# EAGLE design oresat0-backplane (EAGLE 9.6.2)

## Sheet 1 of 9: Slot 1
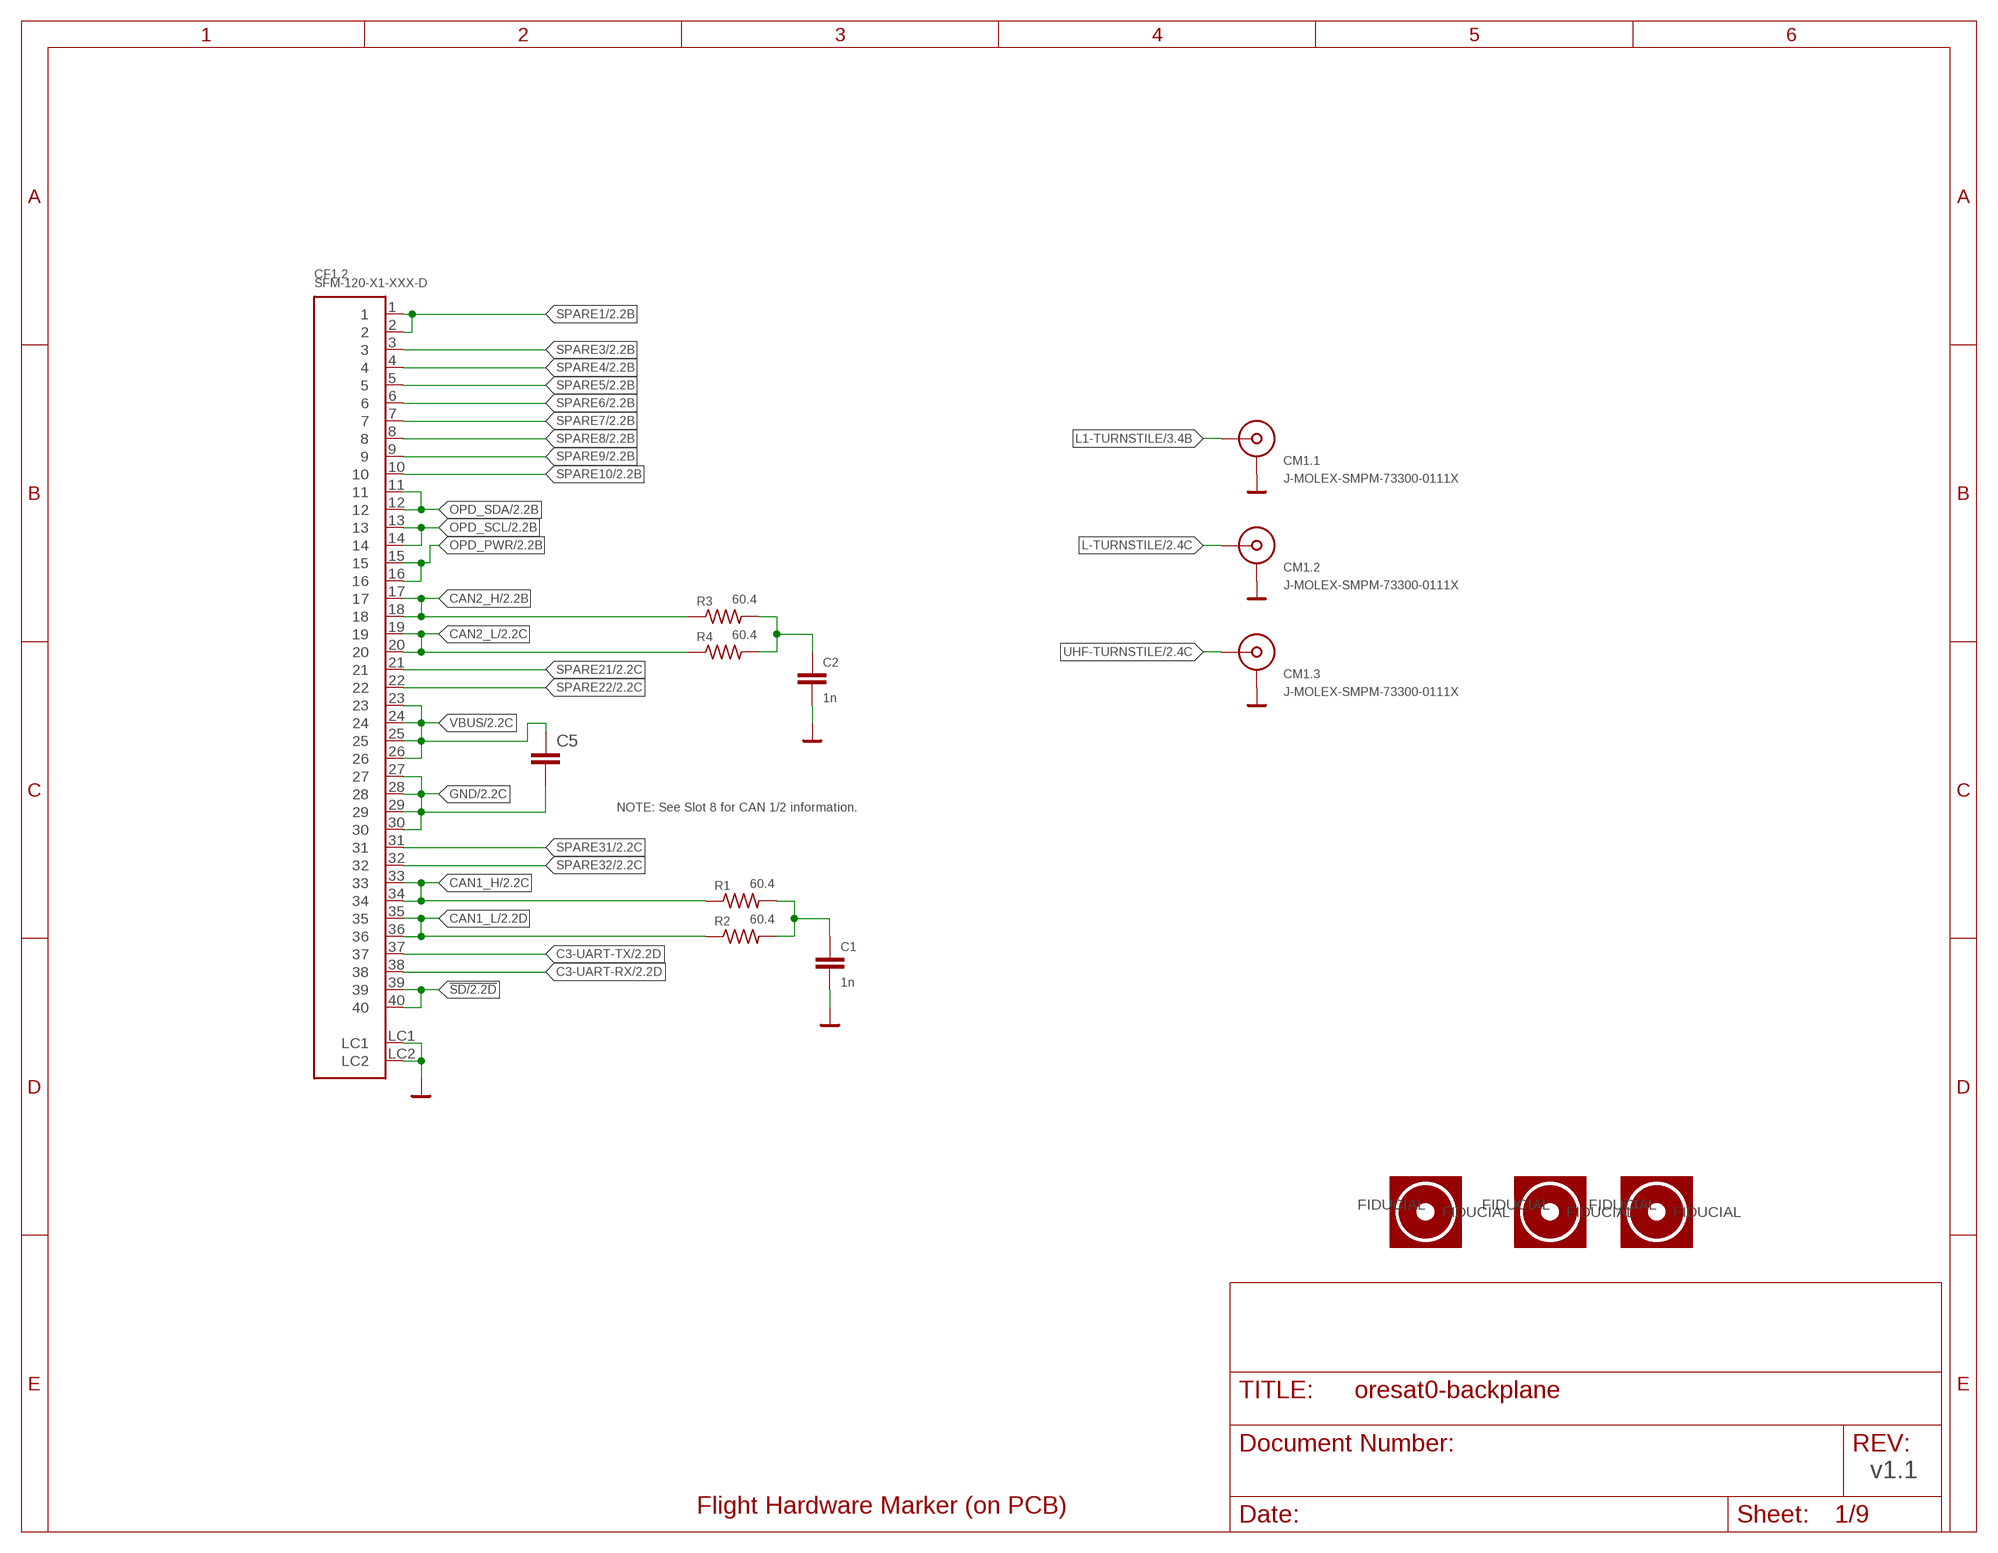
[diagram p0: schematic, sheet 1]

### Parts
C1  1n  C-EU0603-C-NOSILK  [.0603-C-NOSILK]
C2  1n  C-EU0603-C-NOSILK  [.0603-C-NOSILK]
C5  C-EU1206-B  [1206-B]
CF1.2  SFM-120-X1-XXX-D  [SFM-120-X1-XXX-D]
CM1.1  J-MOLEX-SMPM-73300-0111X  [J-MOLEX-SMPM-73300-0111X]
CM1.2  J-MOLEX-SMPM-73300-0111X  [J-MOLEX-SMPM-73300-0111X]
CM1.3  J-MOLEX-SMPM-73300-0111X  [J-MOLEX-SMPM-73300-0111X]
FIDUCIAL1  FIDUCIAL-1.0X2.0  [FIDUCIAL-1.0X2.0]
FIDUCIAL2  FIDUCIAL-1.0X2.0  [FIDUCIAL-1.0X2.0]
FIDUCIAL3  FIDUCIAL-1.0X2.0  [FIDUCIAL-1.0X2.0]
R1  60.4  R-US_1206-C  [1206-C]
R2  60.4  R-US_1206-C  [1206-C]
R3  60.4  R-US_1206-C  [1206-C]
R4  60.4  R-US_1206-C  [1206-C]
U$1  FLIGHMARKERNEW  [FLIGHTMARKER_NEW_BOARDS]

### Nets
!SD [SHUTDOWN]: CF1.2.39 CF1.2.40 ; also sheet 2,3,4,5,6,7
C3-UART-RX: CF1.2.38 ; also sheet 2,3,4,5,6,7
C3-UART-TX: CF1.2.37 ; also sheet 2,3,4,5,6,7
CAN1_H: CF1.2.33 CF1.2.34 R1.1 ; also sheet 2,3,4,5,6,7,8
CAN1_L: CF1.2.35 CF1.2.36 R2.1 ; also sheet 2,3,4,5,6,7,8
CAN2_H: CF1.2.17 CF1.2.18 R3.1 ; also sheet 2,3,4,5,6,7,8
CAN2_L: CF1.2.19 CF1.2.20 R4.1 ; also sheet 2,3,4,5,6,7,8
GND: C1.2 C2.2 C5.2 CF1.2.27 CF1.2.28 CF1.2.29 CF1.2.30 CF1.2.LC1 CF1.2.LC2 CM1.1.P$1(SHIELD1) CM1.1.P$2(SHIELD1) CM1.1.P$3(SHIELD1) CM1.1.P$4(SHIELD1) CM1.2.P$1(SHIELD1) CM1.2.P$2(SHIELD1) CM1.2.P$3(SHIELD1) CM1.2.P$4(SHIELD1) CM1.3.P$1(SHIELD1) CM1.3.P$2(SHIELD1) CM1.3.P$3(SHIELD1) CM1.3.P$4(SHIELD1) ; also sheet 2,3,4,5,6,7,8,9
L1-TURNSTILE [RF]: CM1.1.RF-DOWN(RF) ; also sheet 3
L-TURNSTILE [RF]: CM1.2.RF-DOWN(RF) ; also sheet 2
N$1: C2.1 R3.2 R4.2
N$2: C1.1 R1.2 R2.2
OPD_PWR: CF1.2.15 CF1.2.16 ; also sheet 2,3,4,5,6,7
OPD_SCL: CF1.2.13 CF1.2.14 ; also sheet 2,3,4,5,6,7
OPD_SDA: CF1.2.11 CF1.2.12 ; also sheet 2,3,4,5,6,7
SPARE1: CF1.2.1 CF1.2.2 ; also sheet 2,3,4,5,6,7,9
SPARE3: CF1.2.3 ; also sheet 2,3,4,5,6,7,9
SPARE4: CF1.2.4 ; also sheet 2,3,4,5,6,7,9
SPARE5: CF1.2.5 ; also sheet 2,3,4,5,6,7,9
SPARE6: CF1.2.6 ; also sheet 2,3,4,5,6,7,9
SPARE7: CF1.2.7 ; also sheet 2,3,4,5,6,7,9
SPARE8: CF1.2.8 ; also sheet 2,3,4,5,6,7,9
SPARE9: CF1.2.9 ; also sheet 2,3,4,5,6,7,9
SPARE10: CF1.2.10 ; also sheet 2,3,4,5,6,7,9
SPARE21: CF1.2.21 ; also sheet 2,3,4,5,6,7
SPARE22: CF1.2.22 ; also sheet 2,3,4,5,6,7
SPARE31: CF1.2.31 ; also sheet 2,3,4,5,6,7
SPARE32: CF1.2.32 ; also sheet 2,3,4,5,6,7
UHF-TURNSTILE [RF]: CM1.3.RF-DOWN(RF) ; also sheet 2
VBUS: C5.1 CF1.2.23 CF1.2.24 CF1.2.25 CF1.2.26 ; also sheet 2,3,4,5,6,7
Unconnected: FIDUCIAL1.FIDUCIAL FIDUCIAL2.FIDUCIAL FIDUCIAL3.FIDUCIAL

### Notes on the sheet
- NOTE: See Slot 8 for CAN 1/2 information.
- v1.1

## Sheet 2 of 9: Slot 2
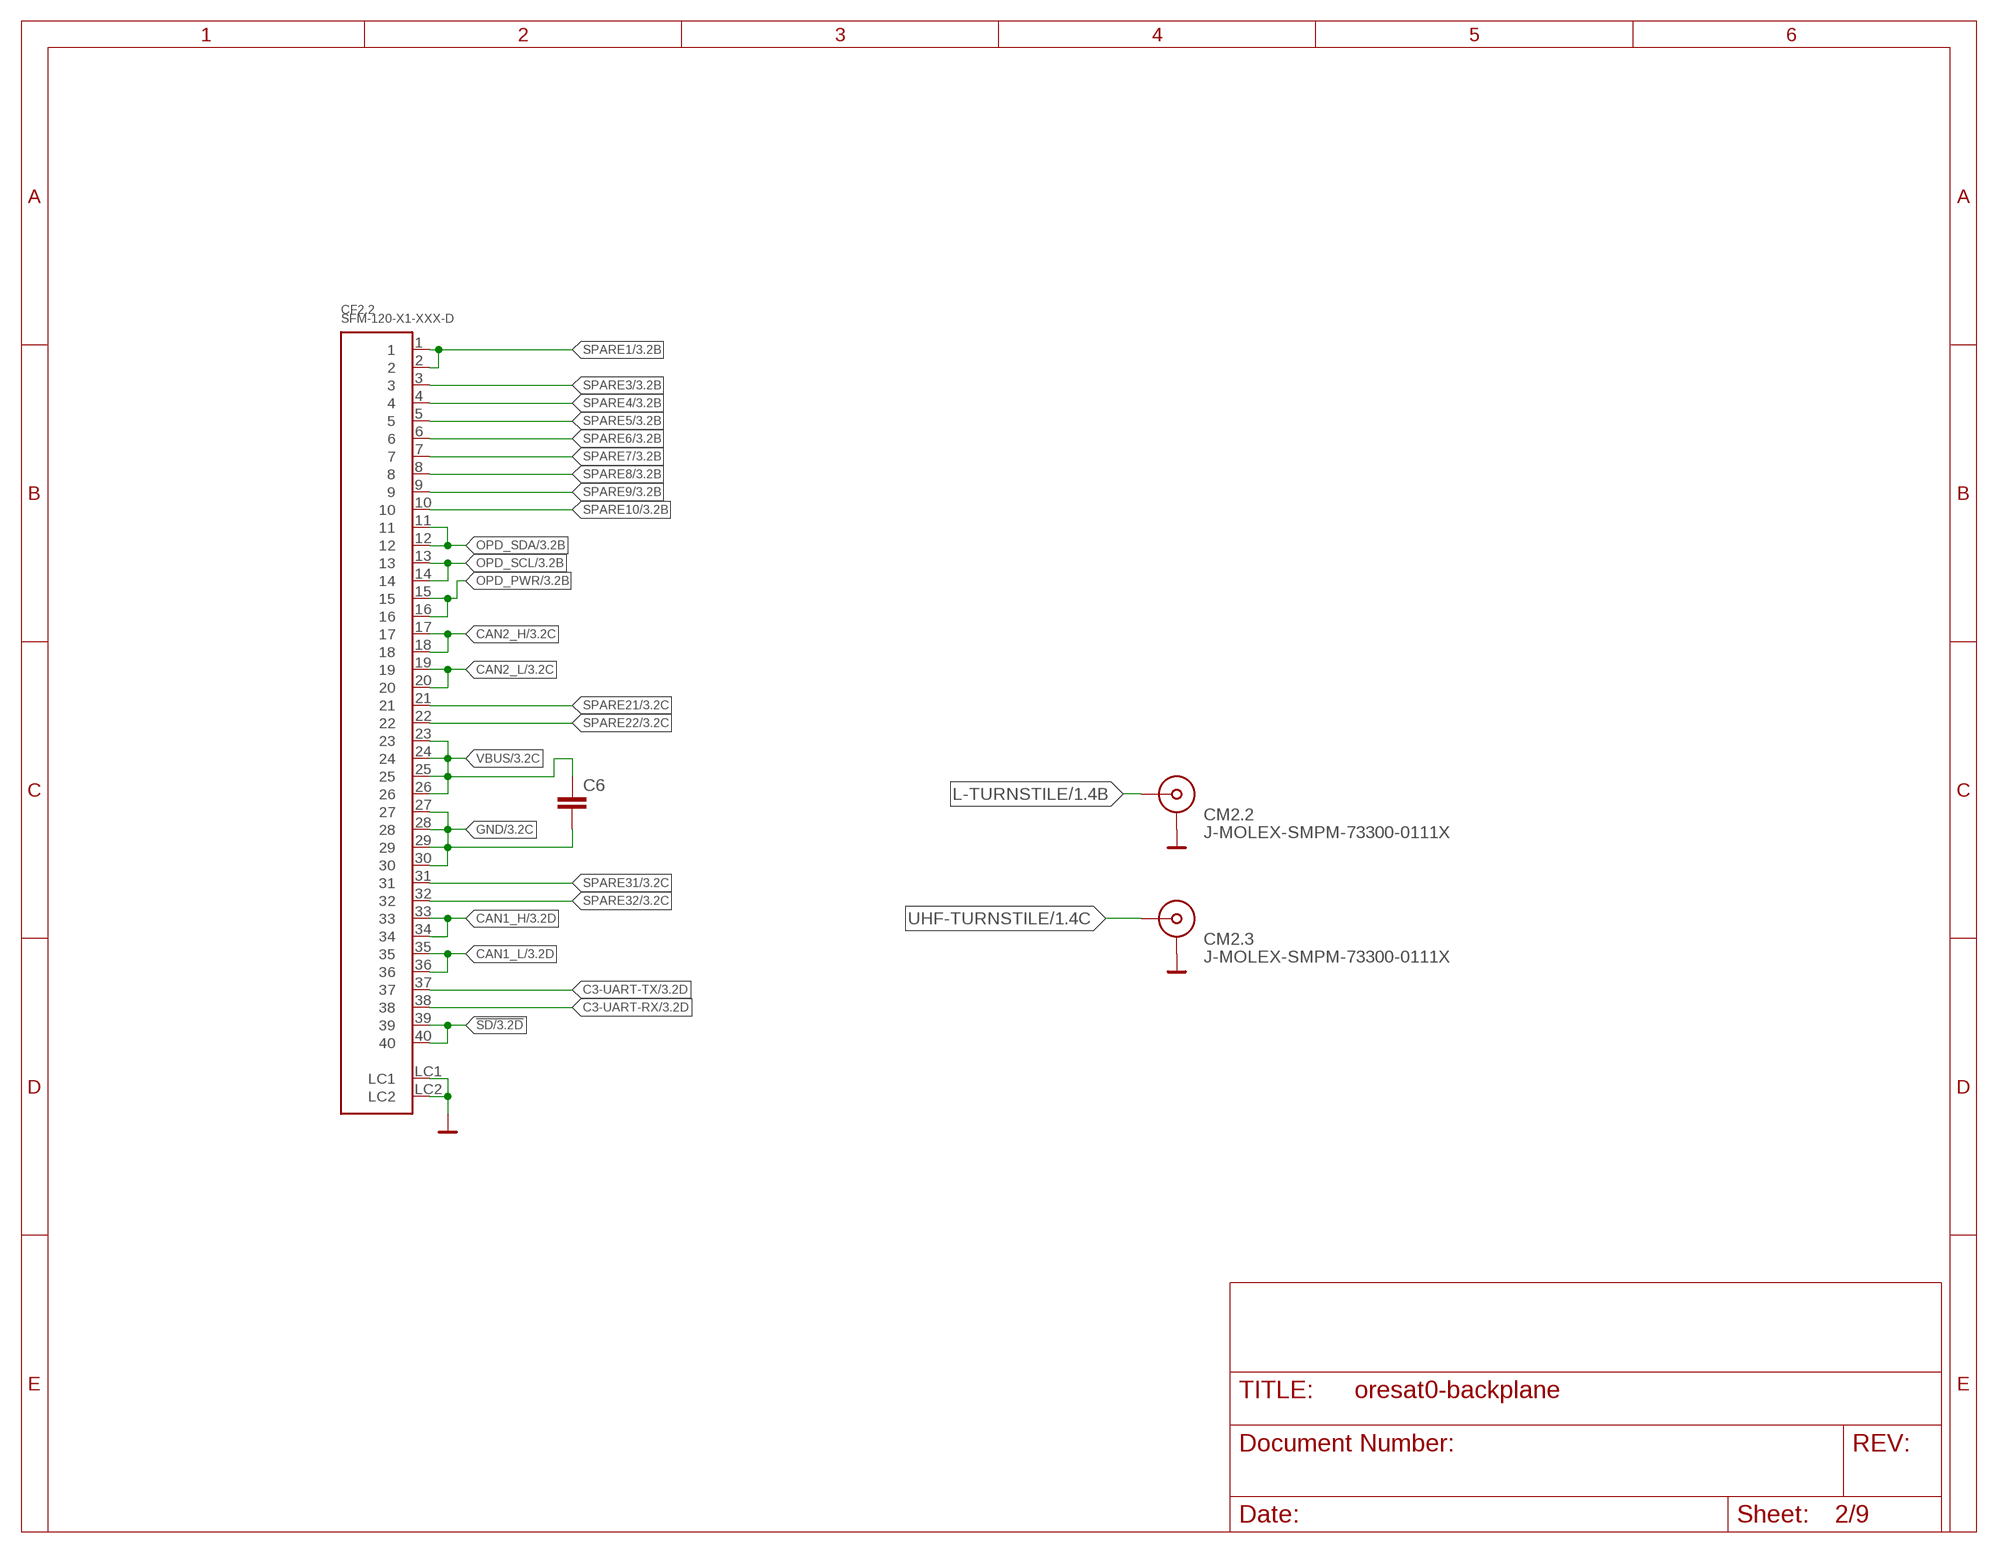
[diagram p1: schematic, sheet 2]

### Parts
C6  C-EU1206-B  [1206-B]
CF2.2  SFM-120-X1-XXX-D  [SFM-120-X1-XXX-D]
CM2.2  J-MOLEX-SMPM-73300-0111X  [J-MOLEX-SMPM-73300-0111X]
CM2.3  J-MOLEX-SMPM-73300-0111X  [J-MOLEX-SMPM-73300-0111X]

### Nets
!SD [SHUTDOWN]: CF2.2.39 CF2.2.40 ; also sheet 1,3,4,5,6,7
C3-UART-RX: CF2.2.38 ; also sheet 1,3,4,5,6,7
C3-UART-TX: CF2.2.37 ; also sheet 1,3,4,5,6,7
CAN1_H: CF2.2.33 CF2.2.34 ; also sheet 1,3,4,5,6,7,8
CAN1_L: CF2.2.35 CF2.2.36 ; also sheet 1,3,4,5,6,7,8
CAN2_H: CF2.2.17 CF2.2.18 ; also sheet 1,3,4,5,6,7,8
CAN2_L: CF2.2.19 CF2.2.20 ; also sheet 1,3,4,5,6,7,8
GND: C6.2 CF2.2.27 CF2.2.28 CF2.2.29 CF2.2.30 CF2.2.LC1 CF2.2.LC2 CM2.2.P$1(SHIELD1) CM2.2.P$2(SHIELD1) CM2.2.P$3(SHIELD1) CM2.2.P$4(SHIELD1) CM2.3.P$1(SHIELD1) CM2.3.P$2(SHIELD1) CM2.3.P$3(SHIELD1) CM2.3.P$4(SHIELD1) ; also sheet 1,3,4,5,6,7,8,9
L-TURNSTILE [RF]: CM2.2.RF-DOWN(RF) ; also sheet 1
OPD_PWR: CF2.2.15 CF2.2.16 ; also sheet 1,3,4,5,6,7
OPD_SCL: CF2.2.13 CF2.2.14 ; also sheet 1,3,4,5,6,7
OPD_SDA: CF2.2.11 CF2.2.12 ; also sheet 1,3,4,5,6,7
SPARE1: CF2.2.1 CF2.2.2 ; also sheet 1,3,4,5,6,7,9
SPARE3: CF2.2.3 ; also sheet 1,3,4,5,6,7,9
SPARE4: CF2.2.4 ; also sheet 1,3,4,5,6,7,9
SPARE5: CF2.2.5 ; also sheet 1,3,4,5,6,7,9
SPARE6: CF2.2.6 ; also sheet 1,3,4,5,6,7,9
SPARE7: CF2.2.7 ; also sheet 1,3,4,5,6,7,9
SPARE8: CF2.2.8 ; also sheet 1,3,4,5,6,7,9
SPARE9: CF2.2.9 ; also sheet 1,3,4,5,6,7,9
SPARE10: CF2.2.10 ; also sheet 1,3,4,5,6,7,9
SPARE21: CF2.2.21 ; also sheet 1,3,4,5,6,7
SPARE22: CF2.2.22 ; also sheet 1,3,4,5,6,7
SPARE31: CF2.2.31 ; also sheet 1,3,4,5,6,7
SPARE32: CF2.2.32 ; also sheet 1,3,4,5,6,7
UHF-TURNSTILE [RF]: CM2.3.RF-DOWN(RF) ; also sheet 1
VBUS: C6.1 CF2.2.23 CF2.2.24 CF2.2.25 CF2.2.26 ; also sheet 1,3,4,5,6,7

## Sheet 3 of 9: Slot 3
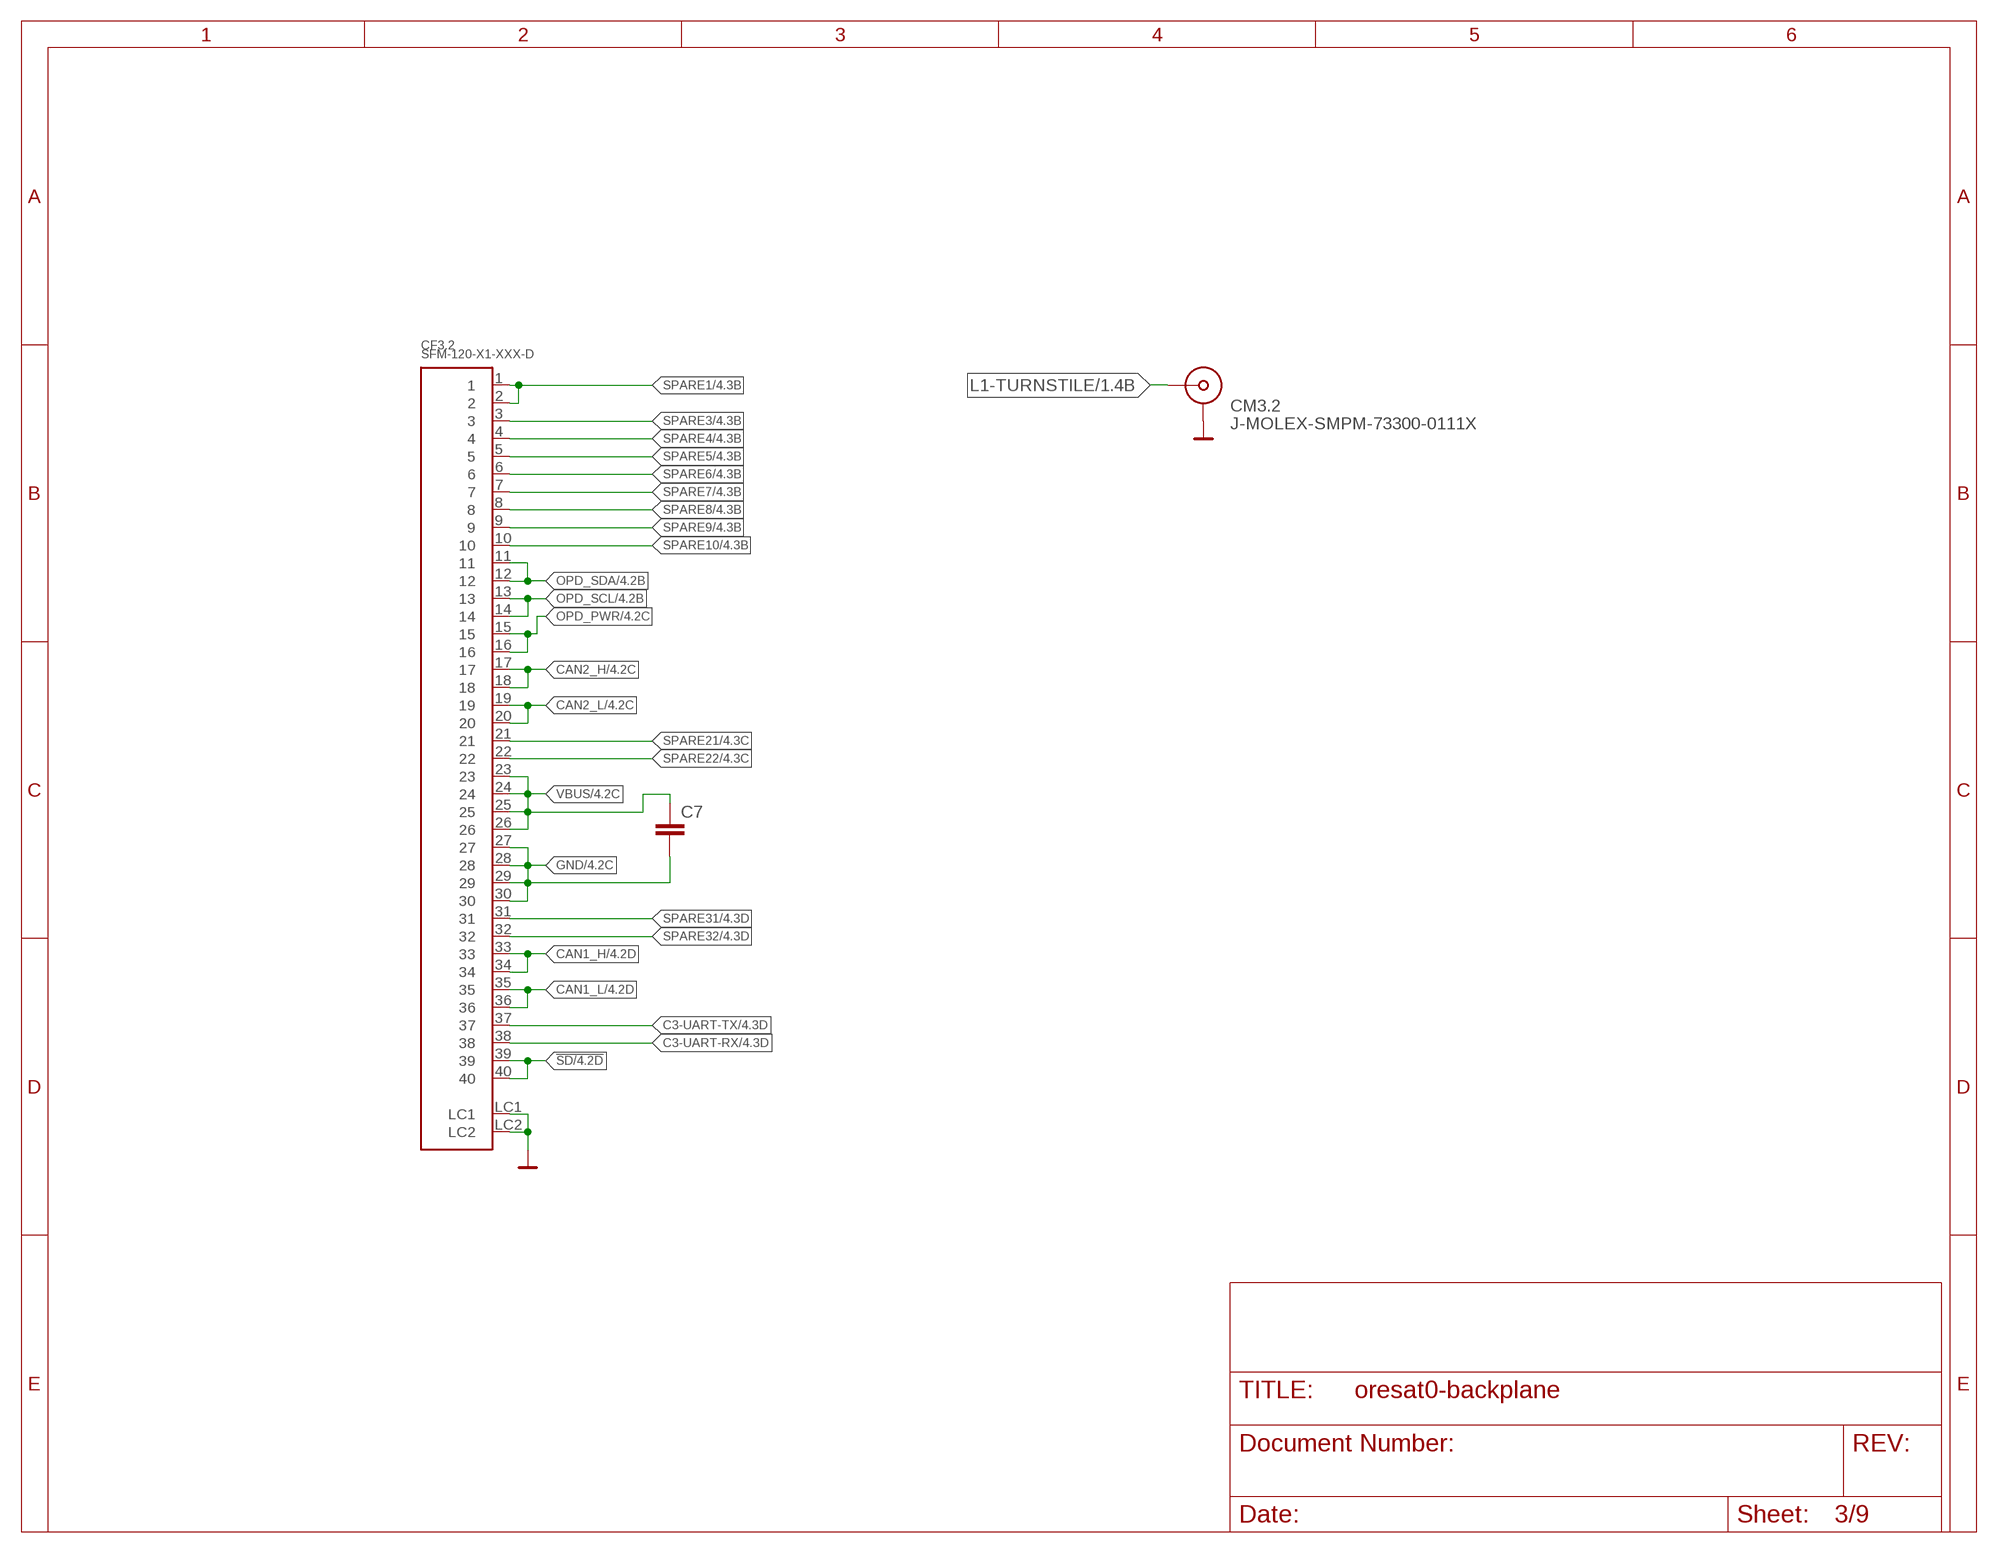
[diagram p2: schematic, sheet 3]

### Parts
C7  C-EU1206-B  [1206-B]
CF3.2  SFM-120-X1-XXX-D  [SFM-120-X1-XXX-D]
CM3.2  J-MOLEX-SMPM-73300-0111X  [J-MOLEX-SMPM-73300-0111X]

### Nets
!SD [SHUTDOWN]: CF3.2.39 CF3.2.40 ; also sheet 1,2,4,5,6,7
C3-UART-RX: CF3.2.38 ; also sheet 1,2,4,5,6,7
C3-UART-TX: CF3.2.37 ; also sheet 1,2,4,5,6,7
CAN1_H: CF3.2.33 CF3.2.34 ; also sheet 1,2,4,5,6,7,8
CAN1_L: CF3.2.35 CF3.2.36 ; also sheet 1,2,4,5,6,7,8
CAN2_H: CF3.2.17 CF3.2.18 ; also sheet 1,2,4,5,6,7,8
CAN2_L: CF3.2.19 CF3.2.20 ; also sheet 1,2,4,5,6,7,8
GND: C7.2 CF3.2.27 CF3.2.28 CF3.2.29 CF3.2.30 CF3.2.LC1 CF3.2.LC2 CM3.2.P$1(SHIELD1) CM3.2.P$2(SHIELD1) CM3.2.P$3(SHIELD1) CM3.2.P$4(SHIELD1) ; also sheet 1,2,4,5,6,7,8,9
L1-TURNSTILE [RF]: CM3.2.RF-DOWN(RF) ; also sheet 1
OPD_PWR: CF3.2.15 CF3.2.16 ; also sheet 1,2,4,5,6,7
OPD_SCL: CF3.2.13 CF3.2.14 ; also sheet 1,2,4,5,6,7
OPD_SDA: CF3.2.11 CF3.2.12 ; also sheet 1,2,4,5,6,7
SPARE1: CF3.2.1 CF3.2.2 ; also sheet 1,2,4,5,6,7,9
SPARE3: CF3.2.3 ; also sheet 1,2,4,5,6,7,9
SPARE4: CF3.2.4 ; also sheet 1,2,4,5,6,7,9
SPARE5: CF3.2.5 ; also sheet 1,2,4,5,6,7,9
SPARE6: CF3.2.6 ; also sheet 1,2,4,5,6,7,9
SPARE7: CF3.2.7 ; also sheet 1,2,4,5,6,7,9
SPARE8: CF3.2.8 ; also sheet 1,2,4,5,6,7,9
SPARE9: CF3.2.9 ; also sheet 1,2,4,5,6,7,9
SPARE10: CF3.2.10 ; also sheet 1,2,4,5,6,7,9
SPARE21: CF3.2.21 ; also sheet 1,2,4,5,6,7
SPARE22: CF3.2.22 ; also sheet 1,2,4,5,6,7
SPARE31: CF3.2.31 ; also sheet 1,2,4,5,6,7
SPARE32: CF3.2.32 ; also sheet 1,2,4,5,6,7
VBUS: C7.1 CF3.2.23 CF3.2.24 CF3.2.25 CF3.2.26 ; also sheet 1,2,4,5,6,7

## Sheet 4 of 9: Slot 4
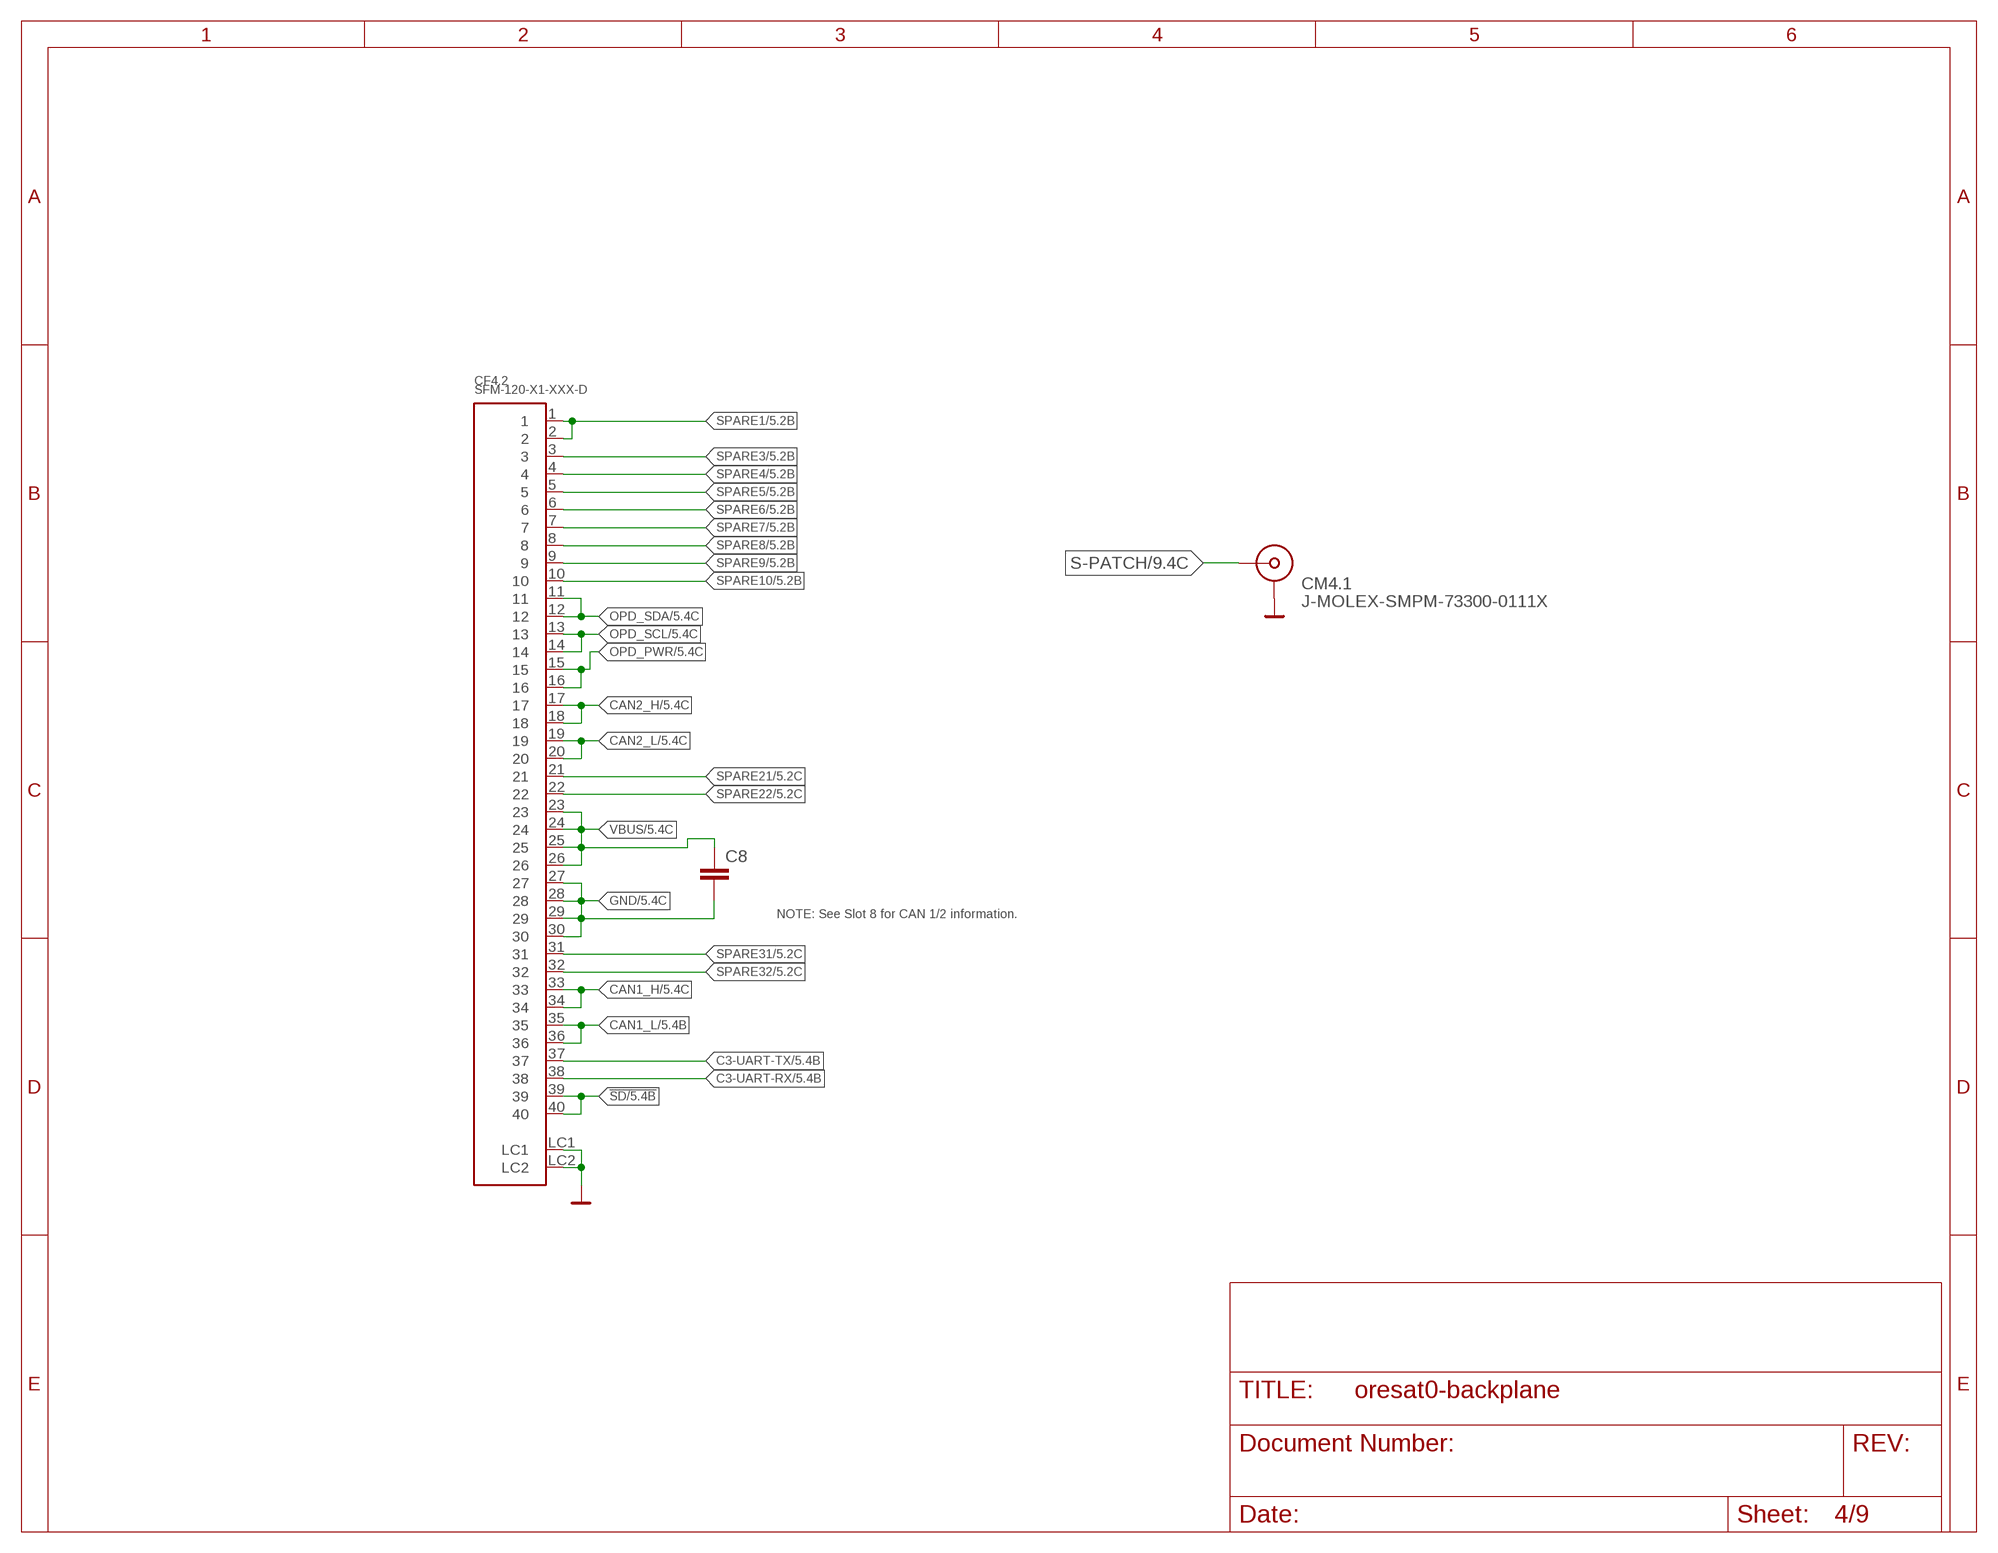
[diagram p3: schematic, sheet 4]

### Parts
C8  C-EU1206-B  [1206-B]
CF4.2  SFM-120-X1-XXX-D  [SFM-120-X1-XXX-D]
CM4.1  J-MOLEX-SMPM-73300-0111X  [J-MOLEX-SMPM-73300-0111X]

### Nets
!SD [SHUTDOWN]: CF4.2.39 CF4.2.40 ; also sheet 1,2,3,5,6,7
C3-UART-RX: CF4.2.38 ; also sheet 1,2,3,5,6,7
C3-UART-TX: CF4.2.37 ; also sheet 1,2,3,5,6,7
CAN1_H: CF4.2.33 CF4.2.34 ; also sheet 1,2,3,5,6,7,8
CAN1_L: CF4.2.35 CF4.2.36 ; also sheet 1,2,3,5,6,7,8
CAN2_H: CF4.2.17 CF4.2.18 ; also sheet 1,2,3,5,6,7,8
CAN2_L: CF4.2.19 CF4.2.20 ; also sheet 1,2,3,5,6,7,8
GND: C8.2 CF4.2.27 CF4.2.28 CF4.2.29 CF4.2.30 CF4.2.LC1 CF4.2.LC2 CM4.1.P$1(SHIELD1) CM4.1.P$2(SHIELD1) CM4.1.P$3(SHIELD1) CM4.1.P$4(SHIELD1) ; also sheet 1,2,3,5,6,7,8,9
OPD_PWR: CF4.2.15 CF4.2.16 ; also sheet 1,2,3,5,6,7
OPD_SCL: CF4.2.13 CF4.2.14 ; also sheet 1,2,3,5,6,7
OPD_SDA: CF4.2.11 CF4.2.12 ; also sheet 1,2,3,5,6,7
S-PATCH [RF]: CM4.1.RF-DOWN(RF) ; also sheet 9
SPARE1: CF4.2.1 CF4.2.2 ; also sheet 1,2,3,5,6,7,9
SPARE3: CF4.2.3 ; also sheet 1,2,3,5,6,7,9
SPARE4: CF4.2.4 ; also sheet 1,2,3,5,6,7,9
SPARE5: CF4.2.5 ; also sheet 1,2,3,5,6,7,9
SPARE6: CF4.2.6 ; also sheet 1,2,3,5,6,7,9
SPARE7: CF4.2.7 ; also sheet 1,2,3,5,6,7,9
SPARE8: CF4.2.8 ; also sheet 1,2,3,5,6,7,9
SPARE9: CF4.2.9 ; also sheet 1,2,3,5,6,7,9
SPARE10: CF4.2.10 ; also sheet 1,2,3,5,6,7,9
SPARE21: CF4.2.21 ; also sheet 1,2,3,5,6,7
SPARE22: CF4.2.22 ; also sheet 1,2,3,5,6,7
SPARE31: CF4.2.31 ; also sheet 1,2,3,5,6,7
SPARE32: CF4.2.32 ; also sheet 1,2,3,5,6,7
VBUS: C8.1 CF4.2.23 CF4.2.24 CF4.2.25 CF4.2.26 ; also sheet 1,2,3,5,6,7

### Notes on the sheet
- NOTE: See Slot 8 for CAN 1/2 information.

## Sheet 5 of 9: Slot 5
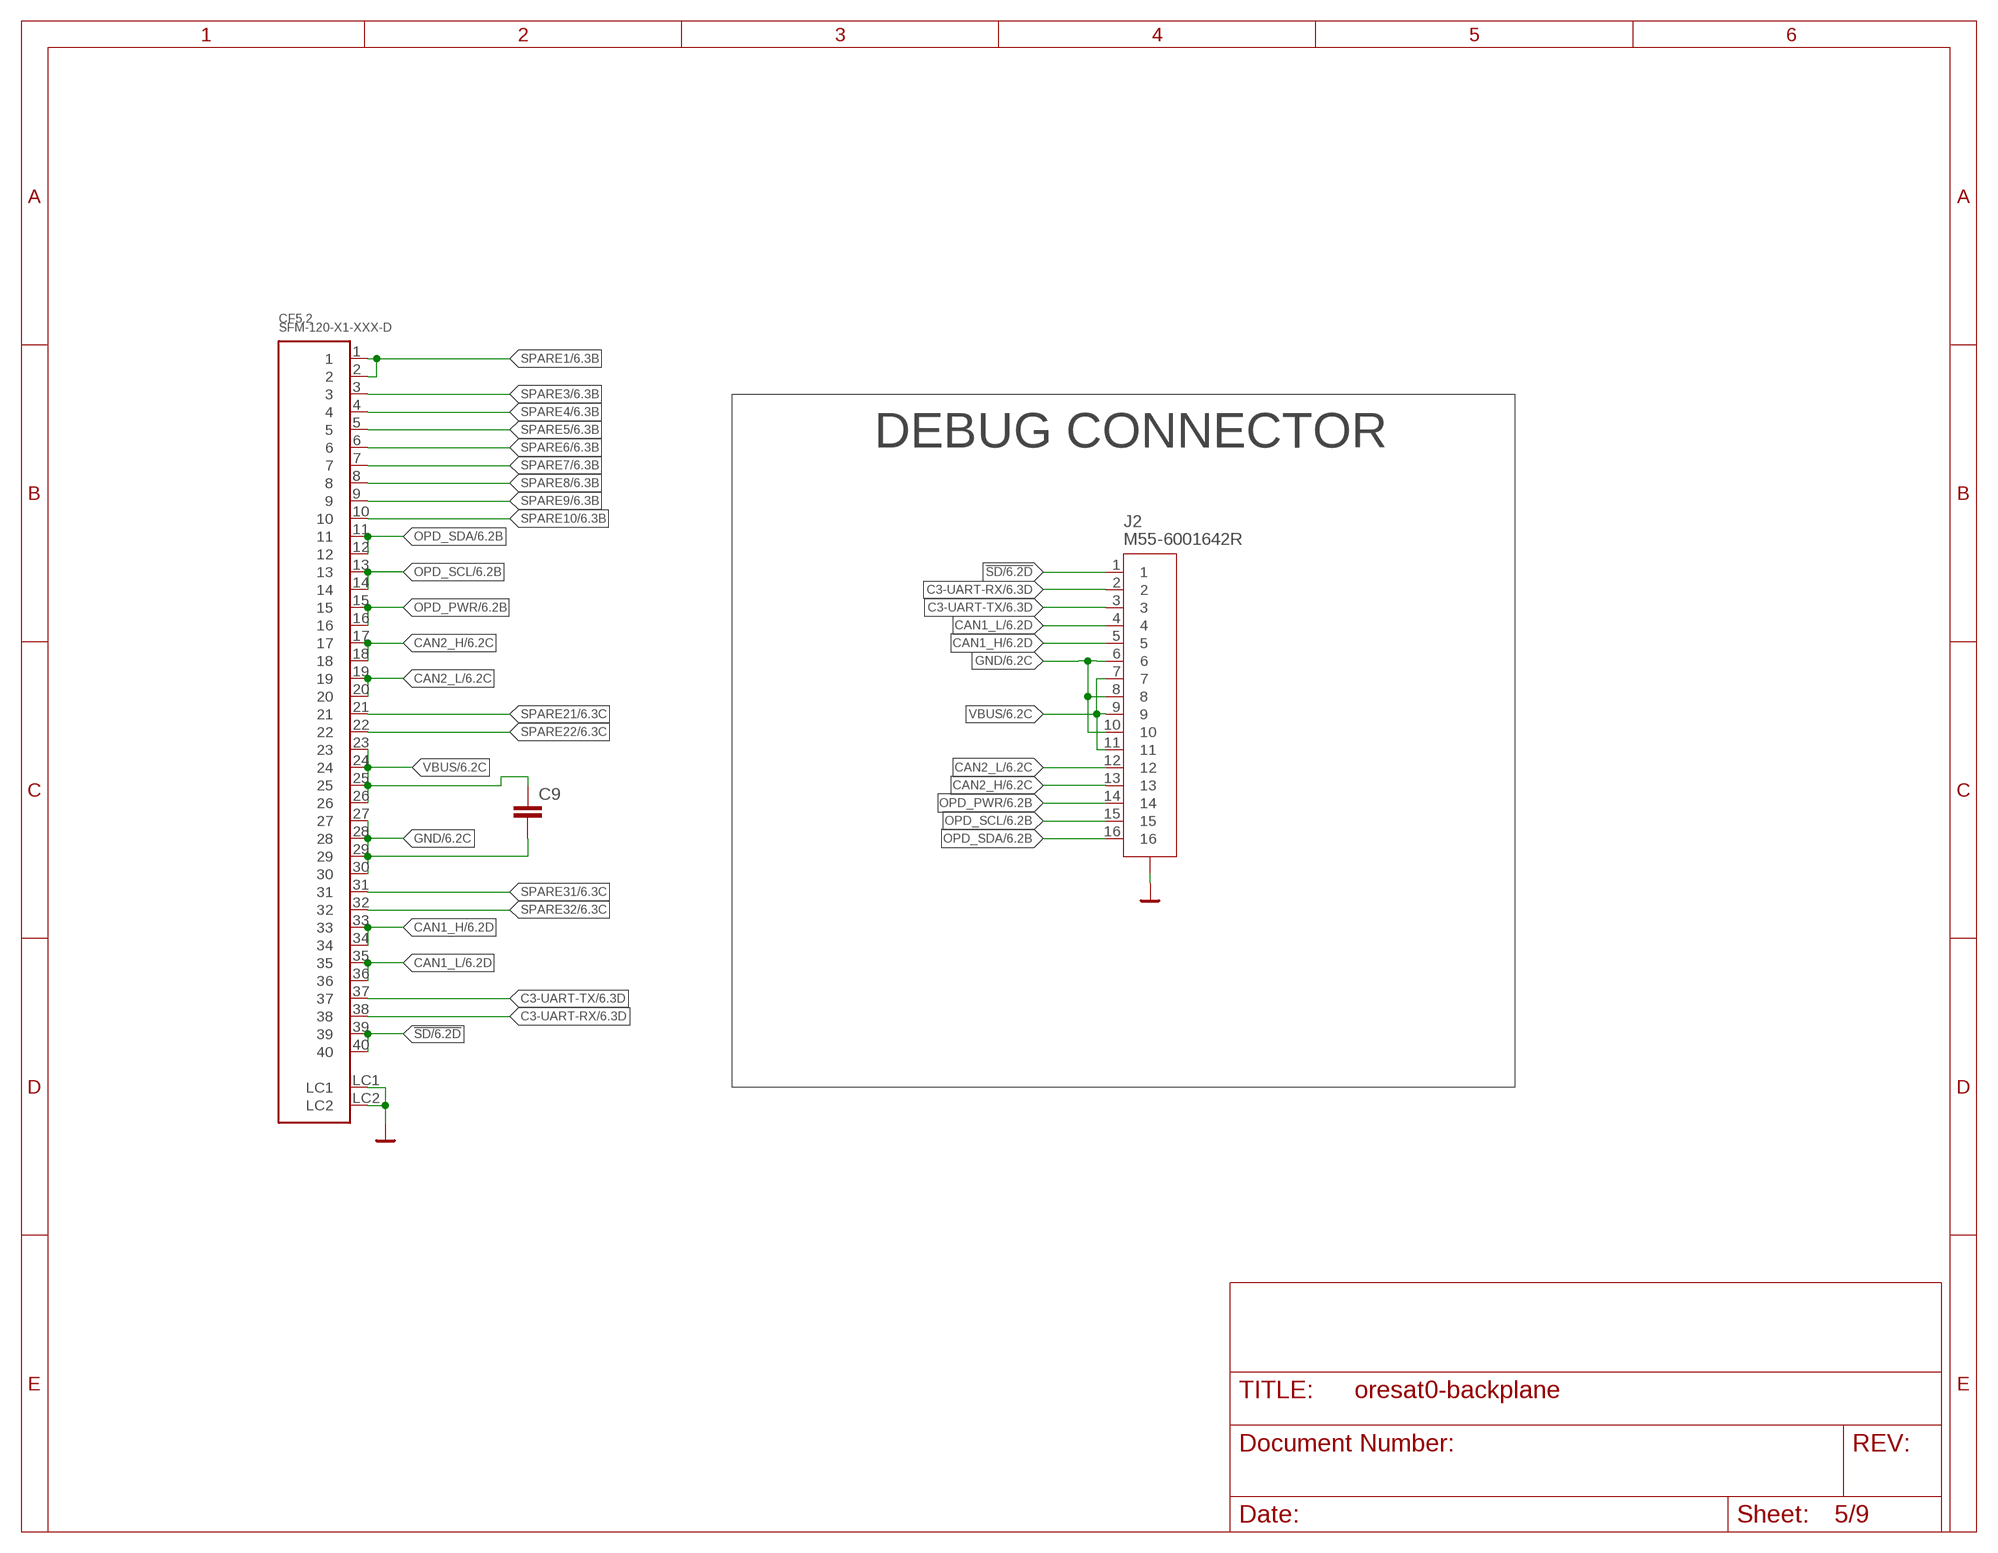
[diagram p4: schematic, sheet 5]

### Parts
C9  C-EU1206-B  [1206-B]
CF5.2  SFM-120-X1-XXX-D  [SFM-120-X1-XXX-D]
J2  M55-6001642R  [CONN_M55-6001642R_HRW]

### Nets
!SD [SHUTDOWN]: CF5.2.39 CF5.2.40 J2.1 ; also sheet 1,2,3,4,6,7
C3-UART-RX: CF5.2.38 J2.2 ; also sheet 1,2,3,4,6,7
C3-UART-TX: CF5.2.37 J2.3 ; also sheet 1,2,3,4,6,7
CAN1_H: CF5.2.33 CF5.2.34 J2.5 ; also sheet 1,2,3,4,6,7,8
CAN1_L: CF5.2.35 CF5.2.36 J2.4 ; also sheet 1,2,3,4,6,7,8
CAN2_H: CF5.2.17 CF5.2.18 J2.13 ; also sheet 1,2,3,4,6,7,8
CAN2_L: CF5.2.19 CF5.2.20 J2.12 ; also sheet 1,2,3,4,6,7,8
GND: C9.2 CF5.2.27 CF5.2.28 CF5.2.29 CF5.2.30 CF5.2.LC1 CF5.2.LC2 J2.6 J2.8 J2.10 J2.19 J2.20 J2.21 J2.22 ; also sheet 1,2,3,4,6,7,8,9
OPD_PWR: CF5.2.15 CF5.2.16 J2.14 ; also sheet 1,2,3,4,6,7
OPD_SCL: CF5.2.13 CF5.2.14 J2.15 ; also sheet 1,2,3,4,6,7
OPD_SDA: CF5.2.11 CF5.2.12 J2.16 ; also sheet 1,2,3,4,6,7
SPARE1: CF5.2.1 CF5.2.2 ; also sheet 1,2,3,4,6,7,9
SPARE3: CF5.2.3 ; also sheet 1,2,3,4,6,7,9
SPARE4: CF5.2.4 ; also sheet 1,2,3,4,6,7,9
SPARE5: CF5.2.5 ; also sheet 1,2,3,4,6,7,9
SPARE6: CF5.2.6 ; also sheet 1,2,3,4,6,7,9
SPARE7: CF5.2.7 ; also sheet 1,2,3,4,6,7,9
SPARE8: CF5.2.8 ; also sheet 1,2,3,4,6,7,9
SPARE9: CF5.2.9 ; also sheet 1,2,3,4,6,7,9
SPARE10: CF5.2.10 ; also sheet 1,2,3,4,6,7,9
SPARE21: CF5.2.21 ; also sheet 1,2,3,4,6,7
SPARE22: CF5.2.22 ; also sheet 1,2,3,4,6,7
SPARE31: CF5.2.31 ; also sheet 1,2,3,4,6,7
SPARE32: CF5.2.32 ; also sheet 1,2,3,4,6,7
VBUS: C9.1 CF5.2.23 CF5.2.24 CF5.2.25 CF5.2.26 J2.7 J2.9 J2.11 ; also sheet 1,2,3,4,6,7

### Notes on the sheet
- DEBUG CONNECTOR

## Sheet 6 of 9: Slot 6
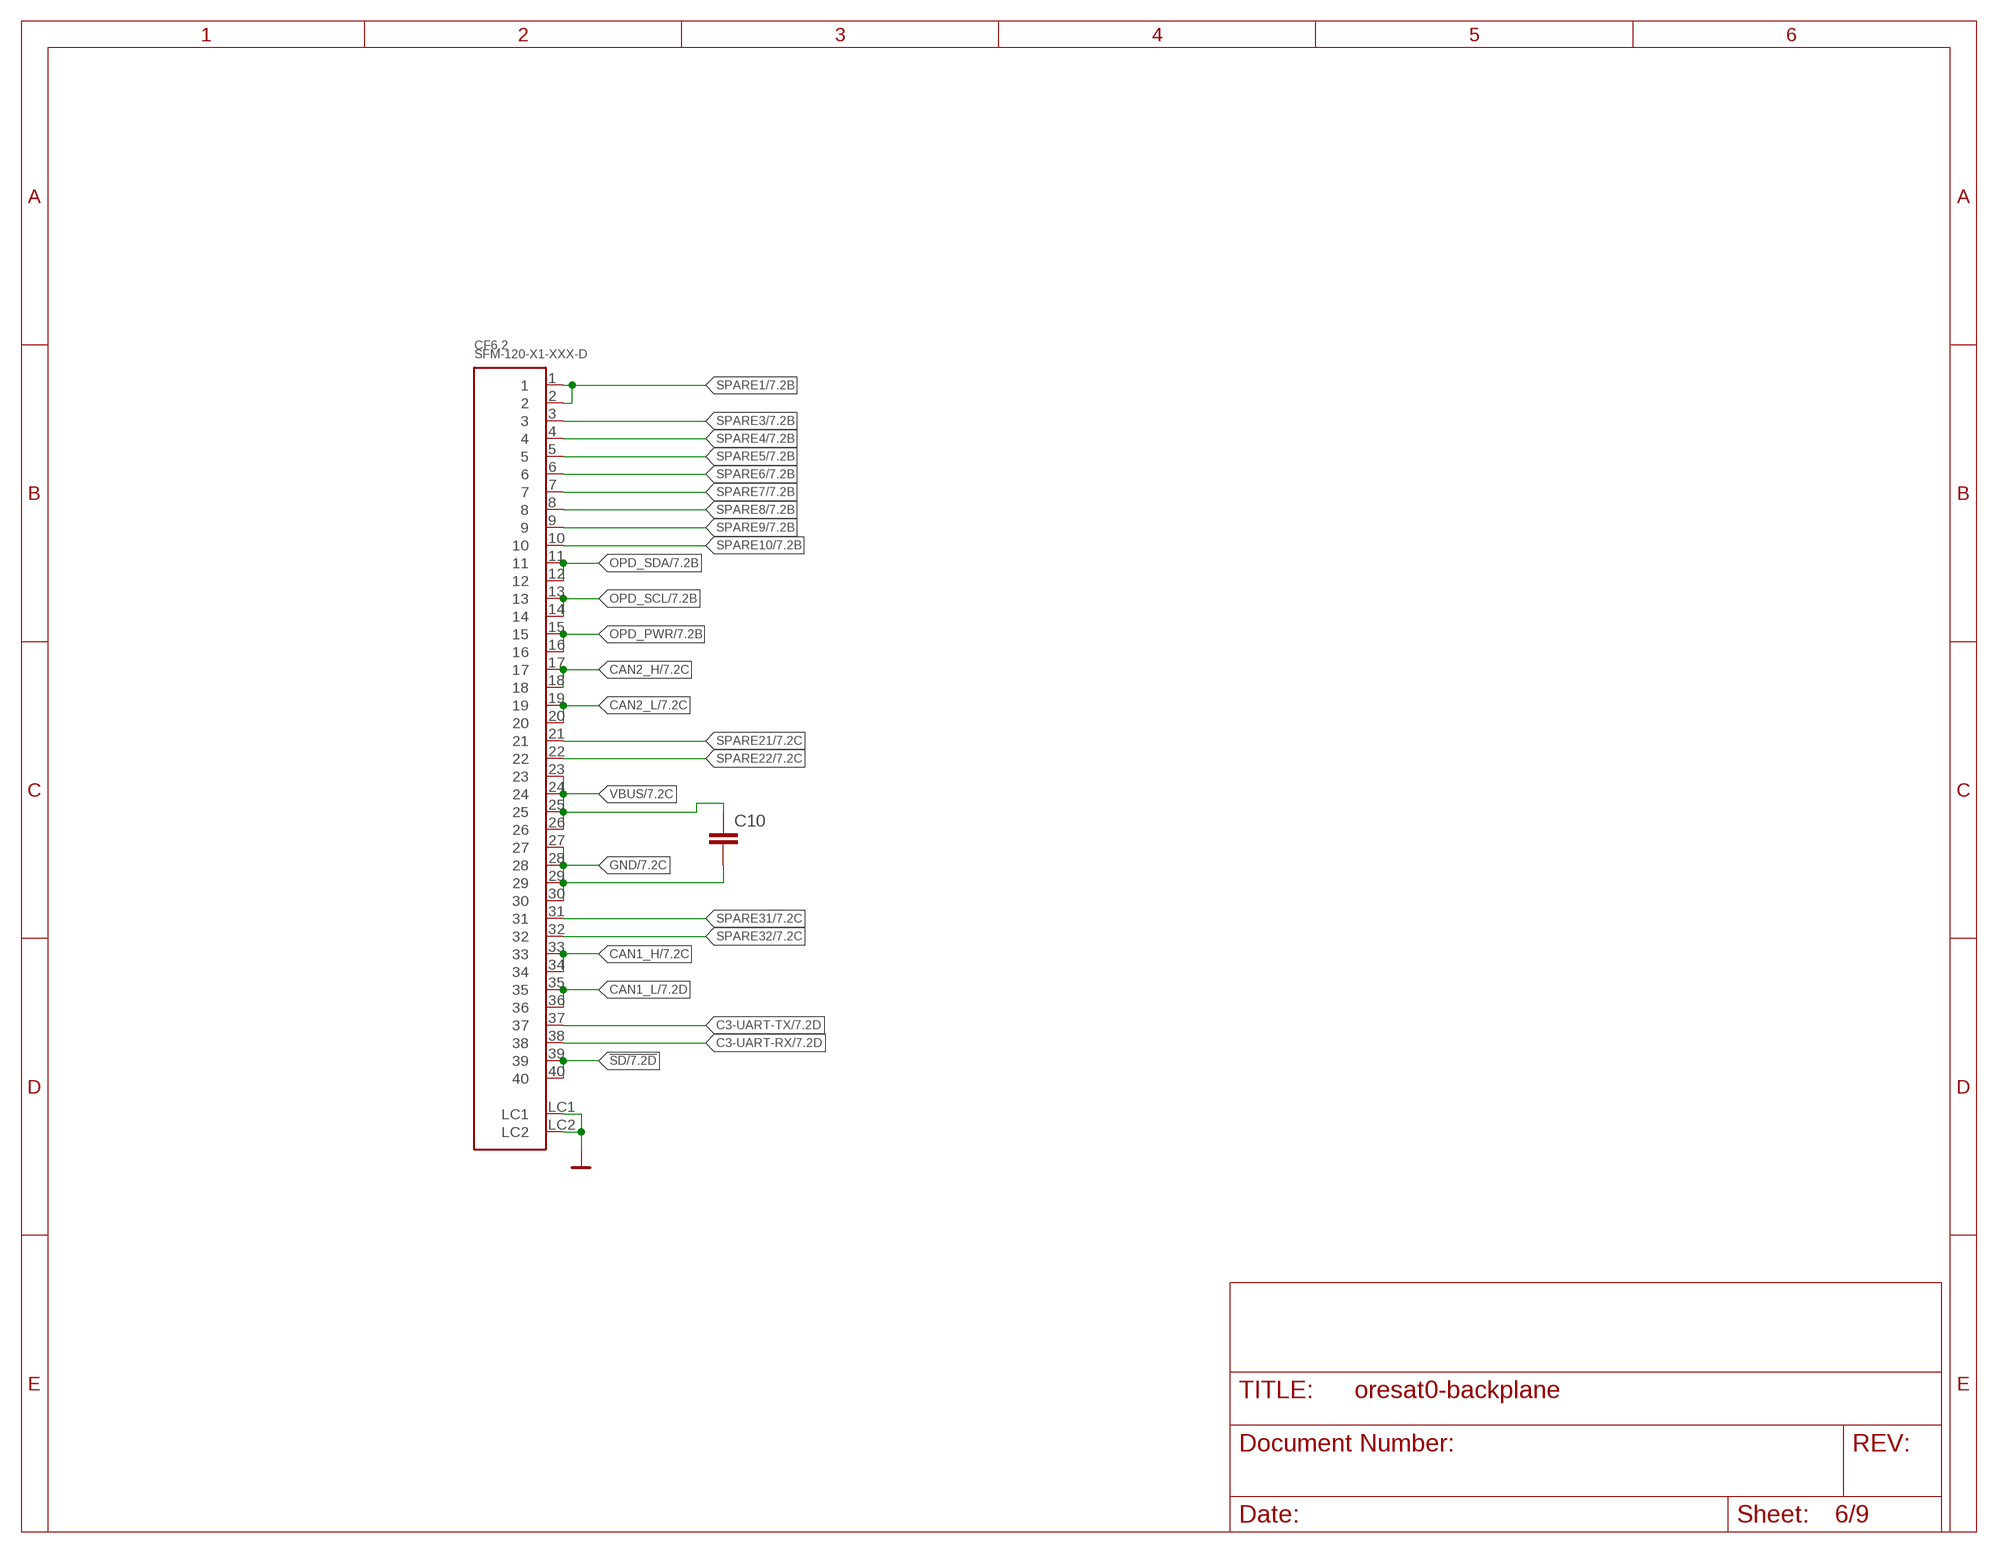
[diagram p5: schematic, sheet 6]

### Parts
C10  C-EU1206-B  [1206-B]
CF6.2  SFM-120-X1-XXX-D  [SFM-120-X1-XXX-D]

### Nets
!SD [SHUTDOWN]: CF6.2.39 CF6.2.40 ; also sheet 1,2,3,4,5,7
C3-UART-RX: CF6.2.38 ; also sheet 1,2,3,4,5,7
C3-UART-TX: CF6.2.37 ; also sheet 1,2,3,4,5,7
CAN1_H: CF6.2.33 CF6.2.34 ; also sheet 1,2,3,4,5,7,8
CAN1_L: CF6.2.35 CF6.2.36 ; also sheet 1,2,3,4,5,7,8
CAN2_H: CF6.2.17 CF6.2.18 ; also sheet 1,2,3,4,5,7,8
CAN2_L: CF6.2.19 CF6.2.20 ; also sheet 1,2,3,4,5,7,8
GND: C10.2 CF6.2.27 CF6.2.28 CF6.2.29 CF6.2.30 CF6.2.LC1 CF6.2.LC2 ; also sheet 1,2,3,4,5,7,8,9
OPD_PWR: CF6.2.15 CF6.2.16 ; also sheet 1,2,3,4,5,7
OPD_SCL: CF6.2.13 CF6.2.14 ; also sheet 1,2,3,4,5,7
OPD_SDA: CF6.2.11 CF6.2.12 ; also sheet 1,2,3,4,5,7
SPARE1: CF6.2.1 CF6.2.2 ; also sheet 1,2,3,4,5,7,9
SPARE3: CF6.2.3 ; also sheet 1,2,3,4,5,7,9
SPARE4: CF6.2.4 ; also sheet 1,2,3,4,5,7,9
SPARE5: CF6.2.5 ; also sheet 1,2,3,4,5,7,9
SPARE6: CF6.2.6 ; also sheet 1,2,3,4,5,7,9
SPARE7: CF6.2.7 ; also sheet 1,2,3,4,5,7,9
SPARE8: CF6.2.8 ; also sheet 1,2,3,4,5,7,9
SPARE9: CF6.2.9 ; also sheet 1,2,3,4,5,7,9
SPARE10: CF6.2.10 ; also sheet 1,2,3,4,5,7,9
SPARE21: CF6.2.21 ; also sheet 1,2,3,4,5,7
SPARE22: CF6.2.22 ; also sheet 1,2,3,4,5,7
SPARE31: CF6.2.31 ; also sheet 1,2,3,4,5,7
SPARE32: CF6.2.32 ; also sheet 1,2,3,4,5,7
VBUS: C10.1 CF6.2.23 CF6.2.24 CF6.2.25 CF6.2.26 ; also sheet 1,2,3,4,5,7

## Sheet 7 of 9: Slot 7
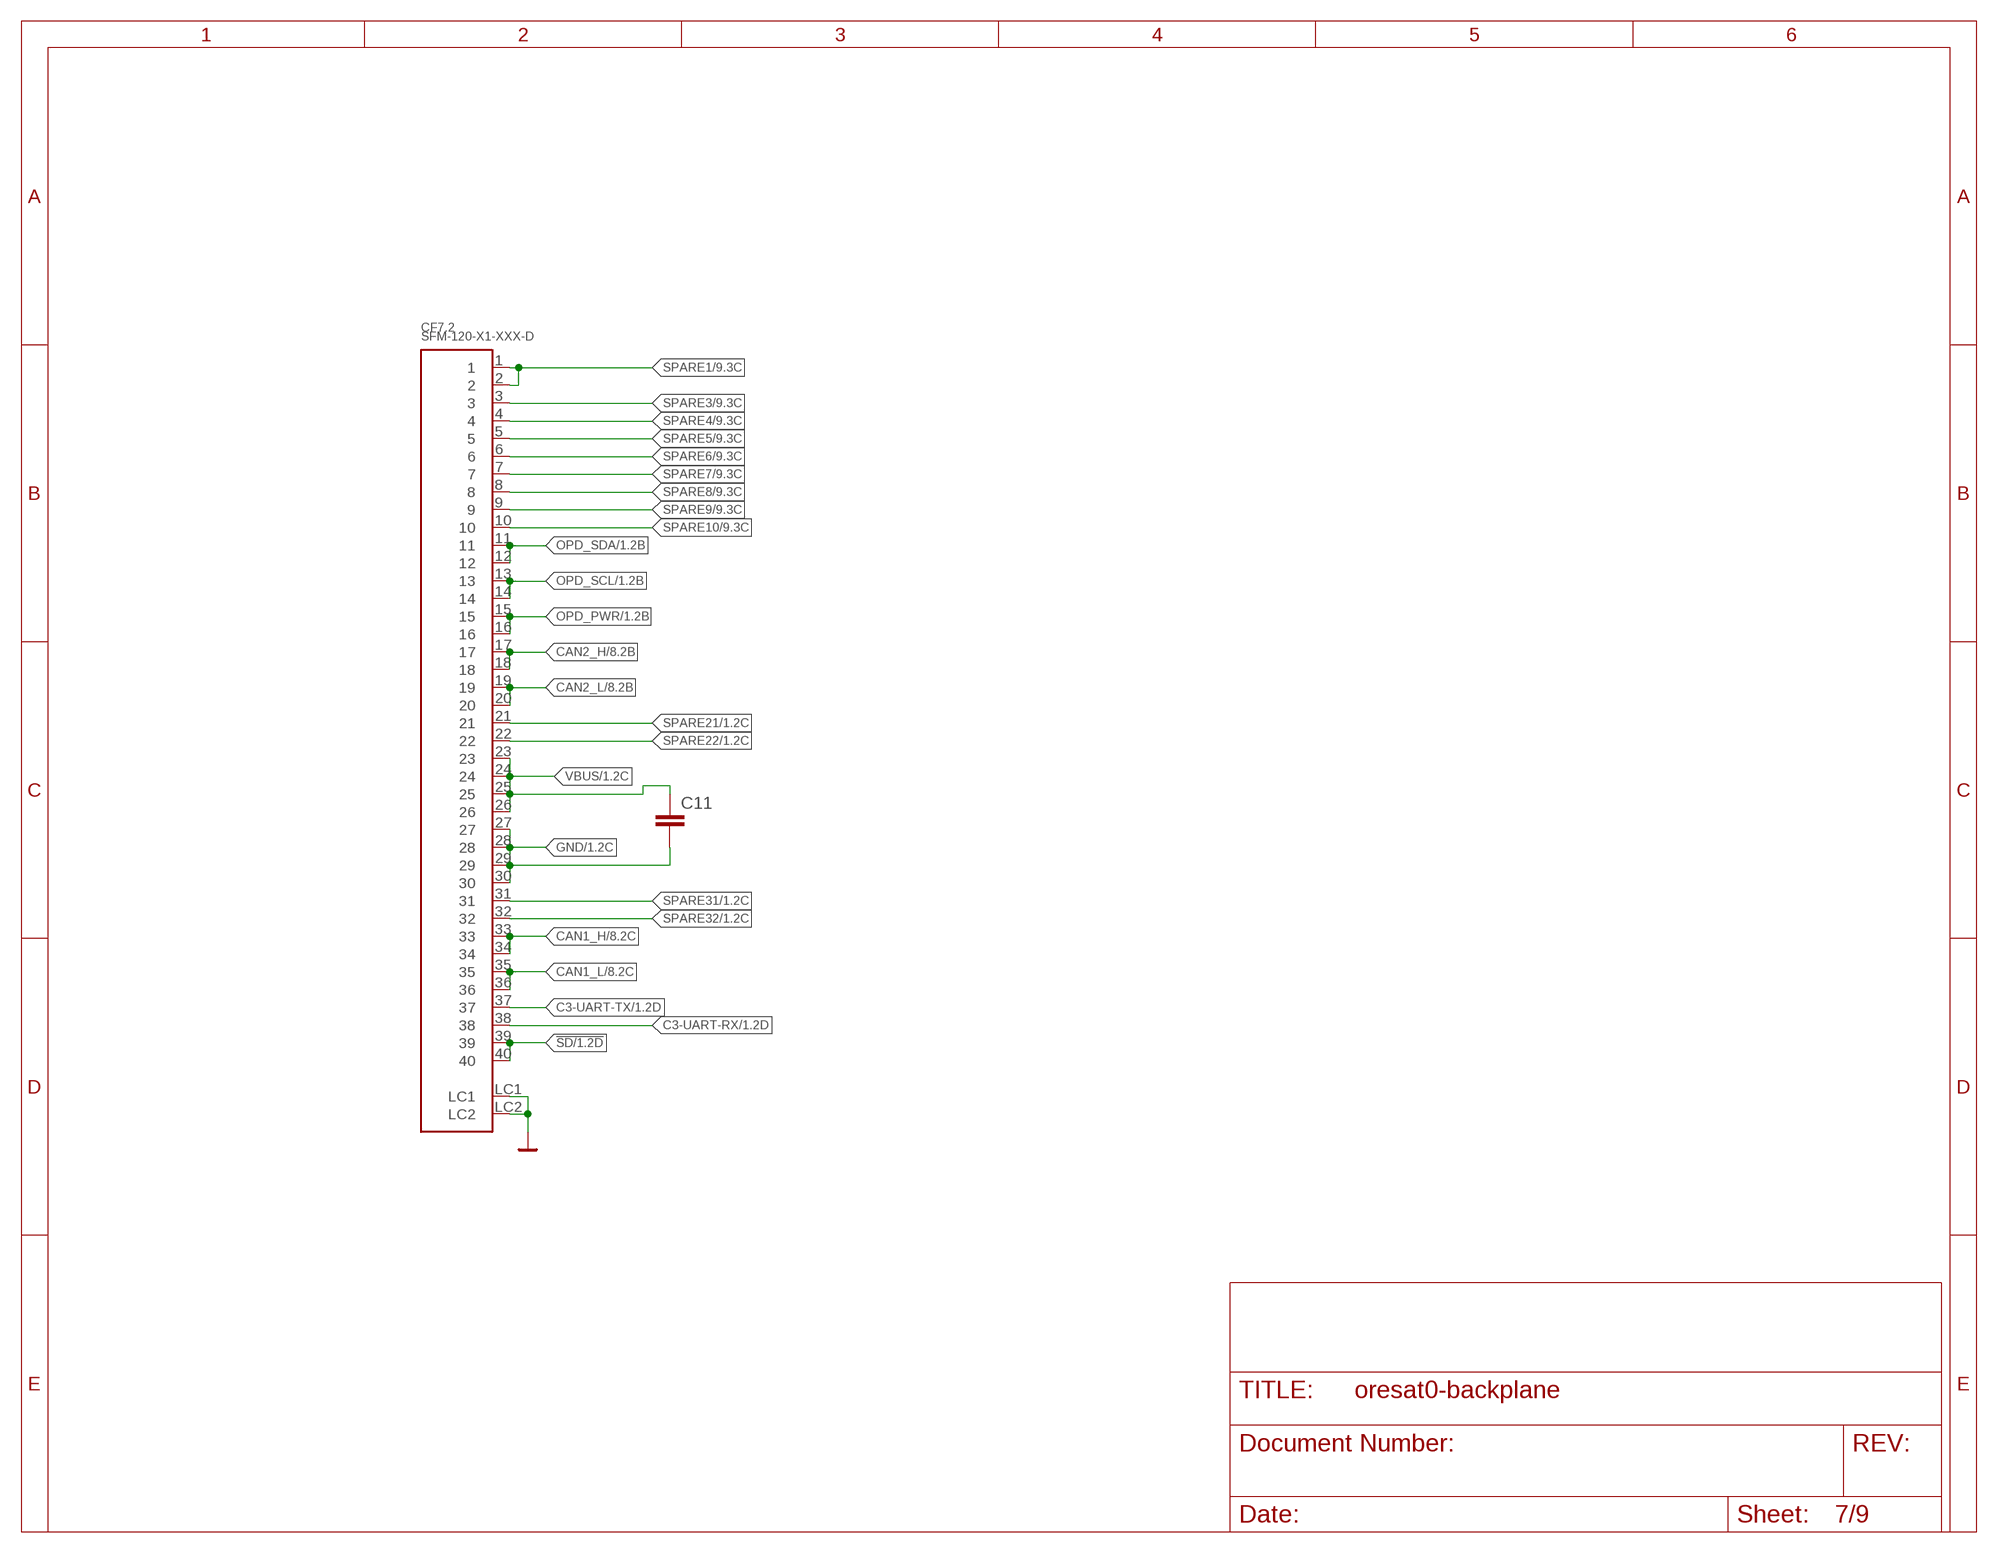
[diagram p6: schematic, sheet 7]

### Parts
C11  C-EU1206-B  [1206-B]
CF7.2  SFM-120-X1-XXX-D  [SFM-120-X1-XXX-D]

### Nets
!SD [SHUTDOWN]: CF7.2.39 CF7.2.40 ; also sheet 1,2,3,4,5,6
C3-UART-RX: CF7.2.38 ; also sheet 1,2,3,4,5,6
C3-UART-TX: CF7.2.37 ; also sheet 1,2,3,4,5,6
CAN1_H: CF7.2.33 CF7.2.34 ; also sheet 1,2,3,4,5,6,8
CAN1_L: CF7.2.35 CF7.2.36 ; also sheet 1,2,3,4,5,6,8
CAN2_H: CF7.2.17 CF7.2.18 ; also sheet 1,2,3,4,5,6,8
CAN2_L: CF7.2.19 CF7.2.20 ; also sheet 1,2,3,4,5,6,8
GND: C11.2 CF7.2.27 CF7.2.28 CF7.2.29 CF7.2.30 CF7.2.LC1 CF7.2.LC2 ; also sheet 1,2,3,4,5,6,8,9
OPD_PWR: CF7.2.15 CF7.2.16 ; also sheet 1,2,3,4,5,6
OPD_SCL: CF7.2.13 CF7.2.14 ; also sheet 1,2,3,4,5,6
OPD_SDA: CF7.2.11 CF7.2.12 ; also sheet 1,2,3,4,5,6
SPARE1: CF7.2.1 CF7.2.2 ; also sheet 1,2,3,4,5,6,9
SPARE3: CF7.2.3 ; also sheet 1,2,3,4,5,6,9
SPARE4: CF7.2.4 ; also sheet 1,2,3,4,5,6,9
SPARE5: CF7.2.5 ; also sheet 1,2,3,4,5,6,9
SPARE6: CF7.2.6 ; also sheet 1,2,3,4,5,6,9
SPARE7: CF7.2.7 ; also sheet 1,2,3,4,5,6,9
SPARE8: CF7.2.8 ; also sheet 1,2,3,4,5,6,9
SPARE9: CF7.2.9 ; also sheet 1,2,3,4,5,6,9
SPARE10: CF7.2.10 ; also sheet 1,2,3,4,5,6,9
SPARE21: CF7.2.21 ; also sheet 1,2,3,4,5,6
SPARE22: CF7.2.22 ; also sheet 1,2,3,4,5,6
SPARE31: CF7.2.31 ; also sheet 1,2,3,4,5,6
SPARE32: CF7.2.32 ; also sheet 1,2,3,4,5,6
VBUS: C11.1 CF7.2.23 CF7.2.24 CF7.2.25 CF7.2.26 ; also sheet 1,2,3,4,5,6

## Sheet 8 of 9: Slot 8
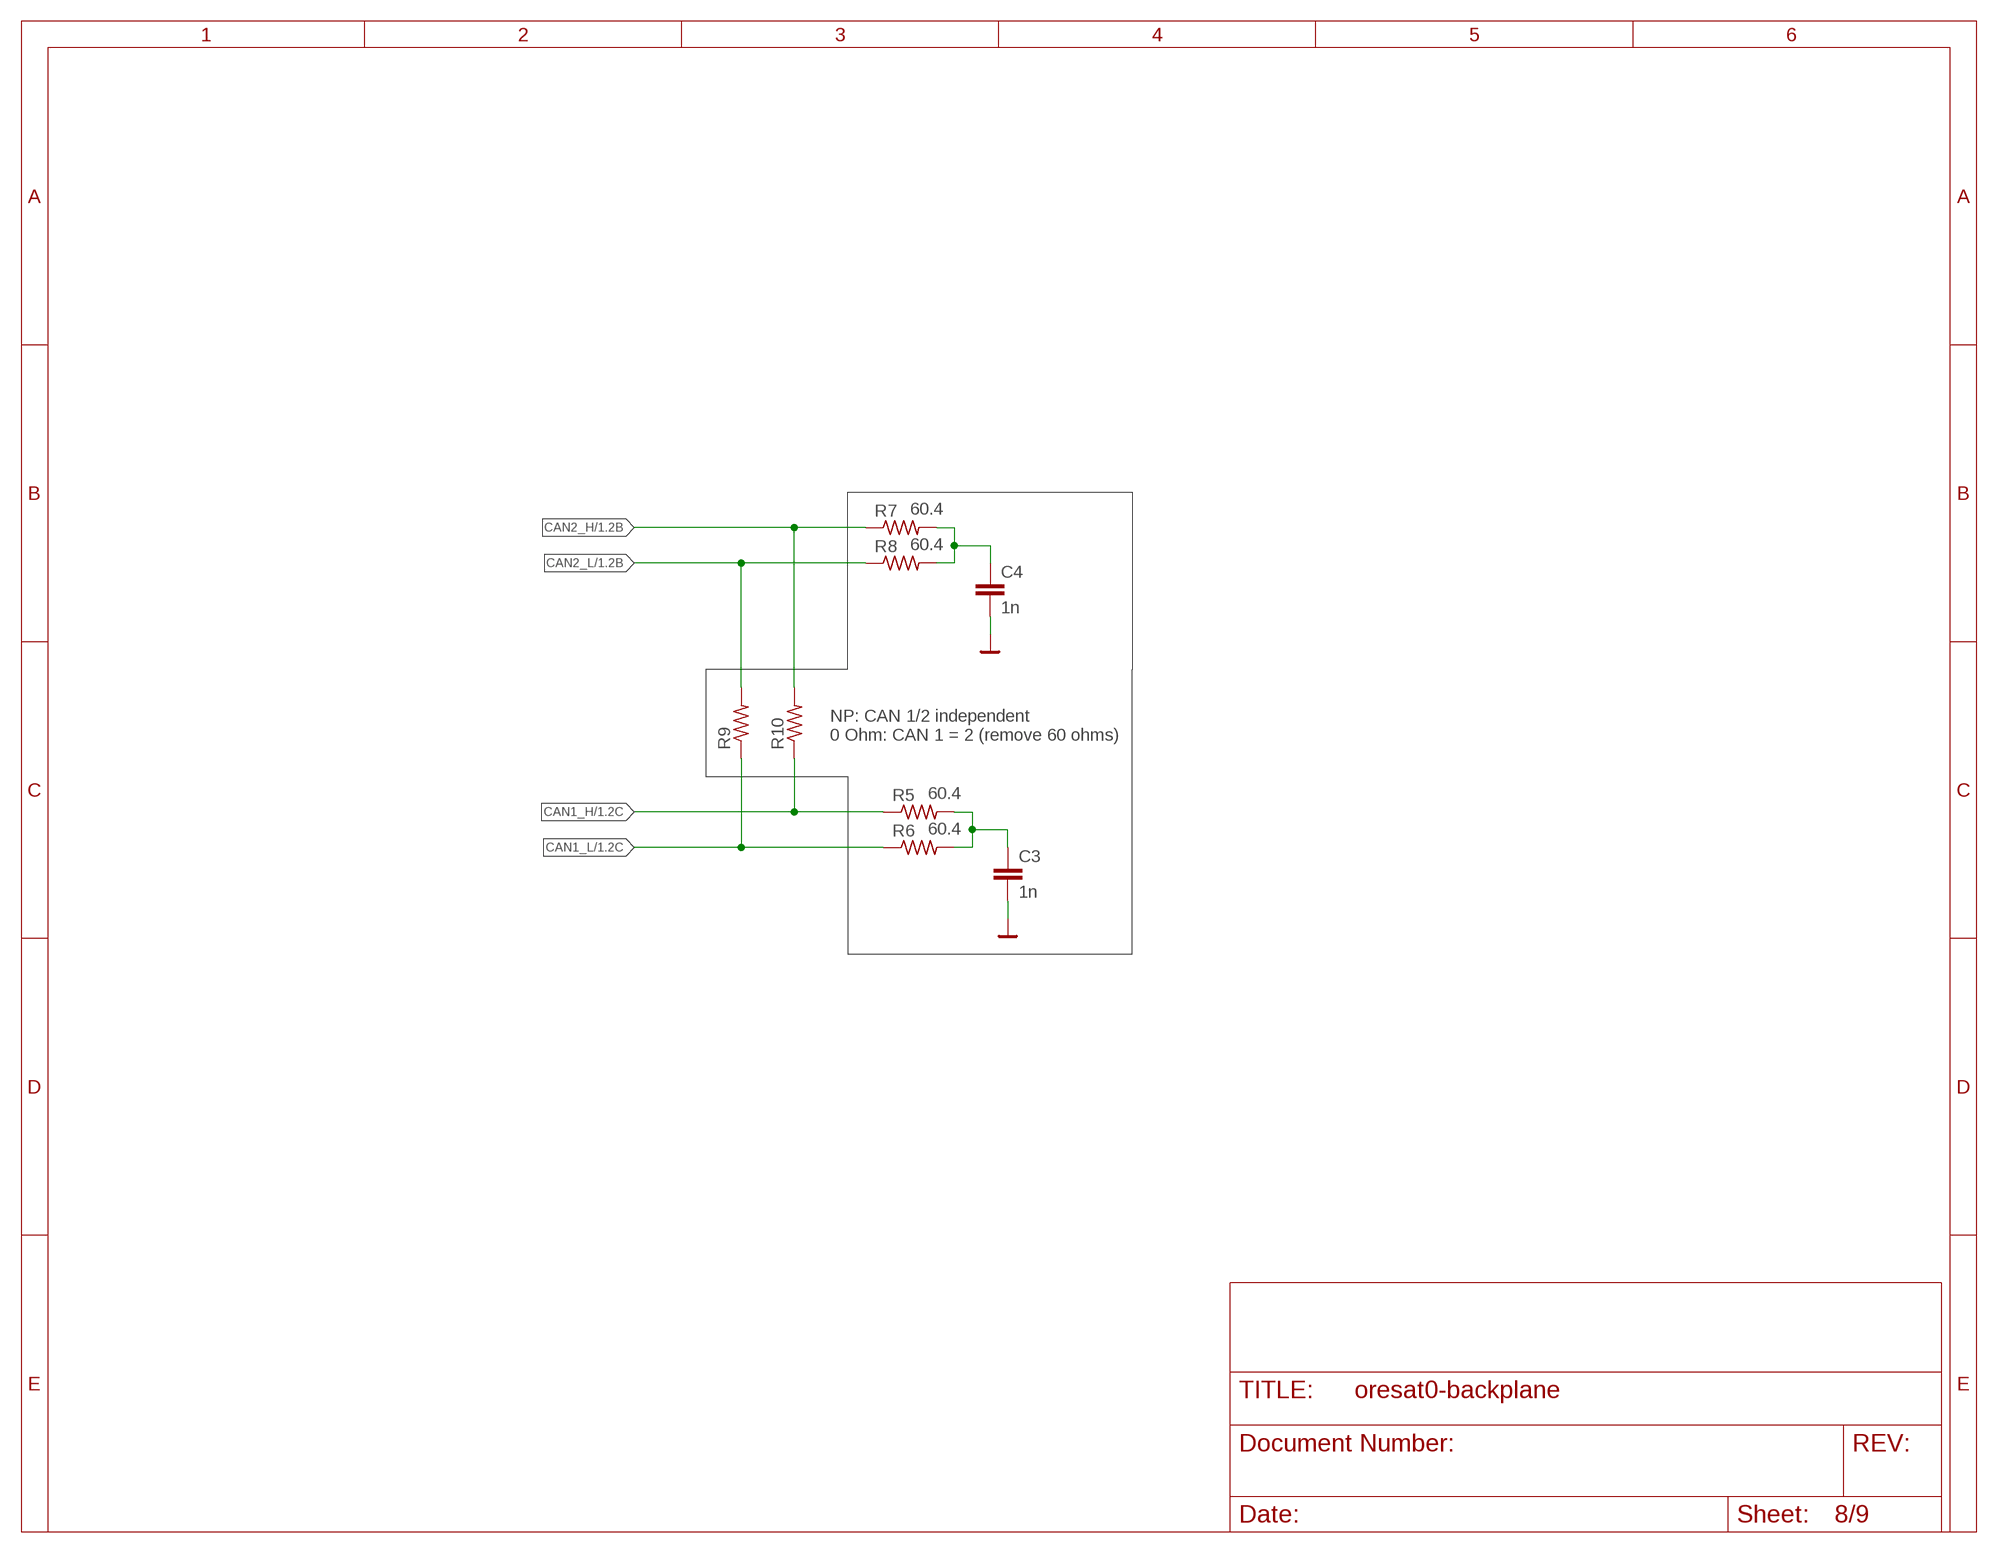
[diagram p7: schematic, sheet 8]

### Parts
C3  1n  C-EU0603-C-NOSILK  [.0603-C-NOSILK]
C4  1n  C-EU0603-C-NOSILK  [.0603-C-NOSILK]
R5  60.4  R-US_1206-C  [1206-C]
R6  60.4  R-US_1206-C  [1206-C]
R7  60.4  R-US_1206-C  [1206-C]
R8  60.4  R-US_1206-C  [1206-C]
R9  R-US_0603-B-NOSILK  [.0603-B-NOSILK]
R10  R-US_0603-B-NOSILK  [.0603-B-NOSILK]

### Nets
CAN1_H: R5.1 R10.1 ; also sheet 1,2,3,4,5,6,7
CAN1_L: R6.1 R9.1 ; also sheet 1,2,3,4,5,6,7
CAN2_H: R7.1 R10.2 ; also sheet 1,2,3,4,5,6,7
CAN2_L: R8.1 R9.2 ; also sheet 1,2,3,4,5,6,7
GND: C3.2 C4.2 ; also sheet 1,2,3,4,5,6,7,9
N$3: C4.1 R7.2 R8.2
N$4: C3.1 R5.2 R6.2

### Notes on the sheet
- NP: CAN 1/2 independent
  0 Ohm: CAN 1 = 2 (remove 60 ohms)

## Sheet 9 of 9: To -Z End Cap
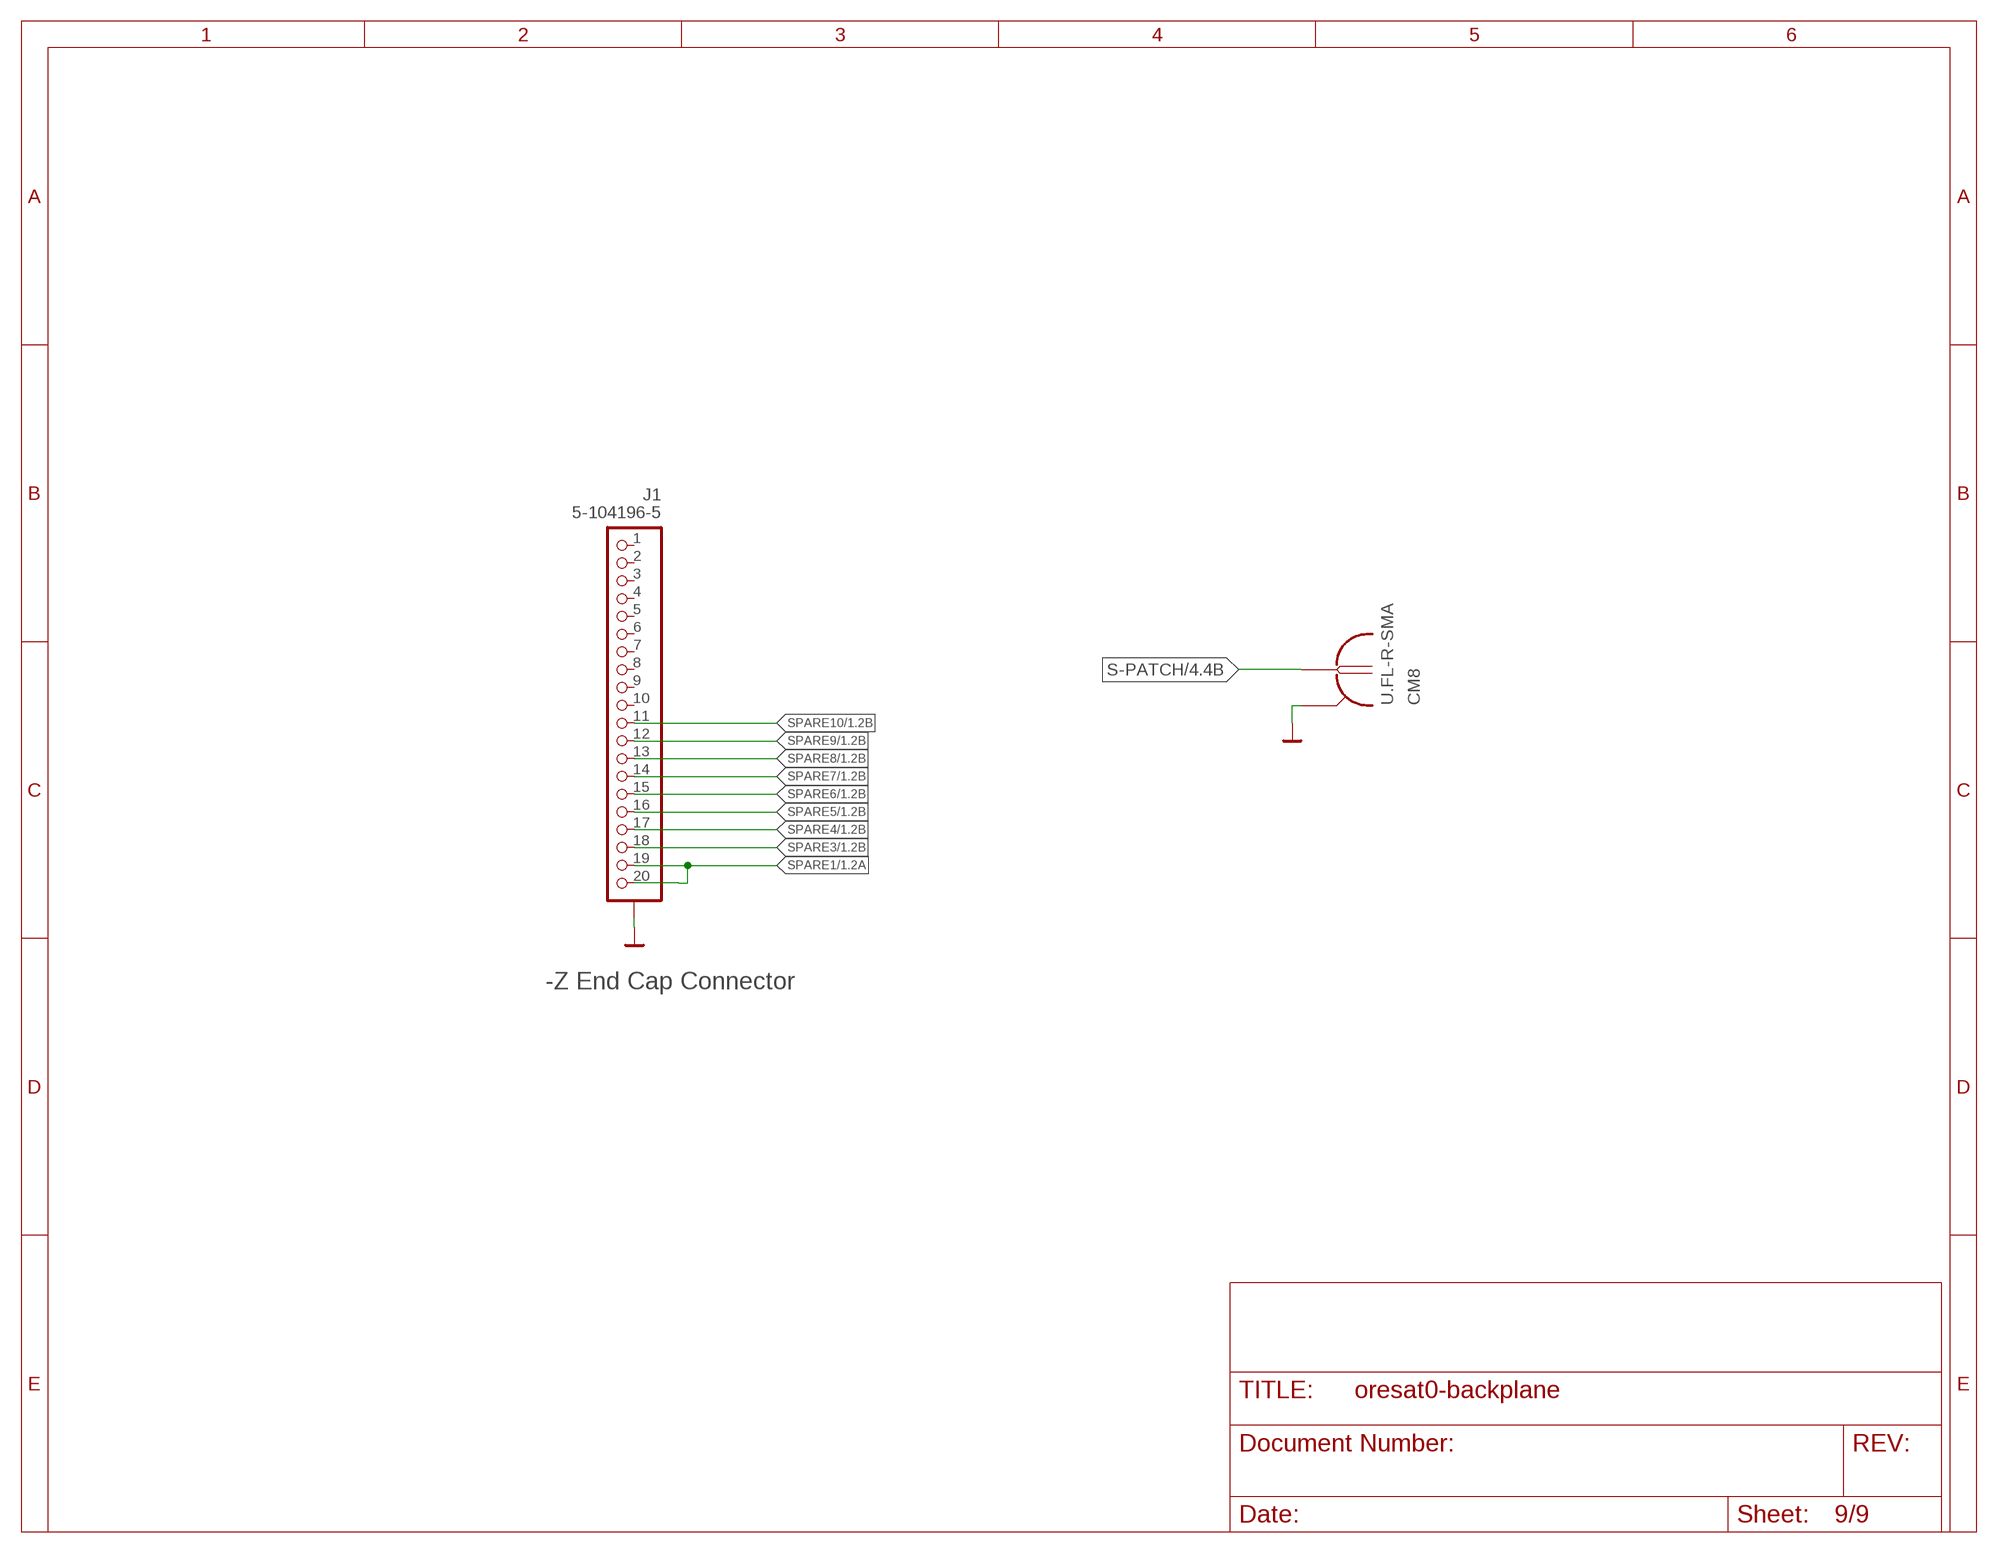
[diagram p8: schematic, sheet 9]

### Parts
CM8  U.FL-R-SMA  [U.FL-R-SMT]
J1  5-104196-5  [5-104196-5]

### Nets
GND: CM8.2 CM8.3 J1.HD1(HD) J1.HD2(HD) J1.HD3(HD) ; also sheet 1,2,3,4,5,6,7,8
S-PATCH [RF]: CM8.1 ; also sheet 4
SPARE1: J1.19 J1.20 ; also sheet 1,2,3,4,5,6,7
SPARE3: J1.18 ; also sheet 1,2,3,4,5,6,7
SPARE4: J1.17 ; also sheet 1,2,3,4,5,6,7
SPARE5: J1.16 ; also sheet 1,2,3,4,5,6,7
SPARE6: J1.15 ; also sheet 1,2,3,4,5,6,7
SPARE7: J1.14 ; also sheet 1,2,3,4,5,6,7
SPARE8: J1.13 ; also sheet 1,2,3,4,5,6,7
SPARE9: J1.12 ; also sheet 1,2,3,4,5,6,7
SPARE10: J1.11 ; also sheet 1,2,3,4,5,6,7
Unconnected: J1.1 J1.2 J1.3 J1.4 J1.5 J1.6 J1.7 J1.8 J1.9 J1.10

### Notes on the sheet
- -Z End Cap Connector

## Library data of the parts
C1-C11 = oresat-rcl:C-EU: CAPACITOR, European symbol
CF1.2 CF2.2 CF3.2 CF4.2 CF5.2 CF6.2 CF7.2 = J-Samtec-SFM-120-X1-XXX-D:SFM-120-X1-XXX-D: 0.05"X0.05" SOCKET STRIP DOUBLE ROW ASSEMBLY. MANUFACTURER: SAMTEC.
CM1.1-CM1.3 CM2.2 CM2.3 CM3.2 CM4.1 = J-Molex-73300-011x-SMPM-M-vertical:J-MOLEX-SMPM-73300-0111X
CM8 = J-HRS-U.FL-R-SMT-1(10)-M-RF:U.FL-R-SMA: Male SMA U.FL Connector: https://www.mouser.com/ProductDetail/Hirose-Connector/UFL-R-SMT-110?qs=kL1ClTr6oBoOdtqlGQpQrQ%3D%3D
FIDUCIAL1-FIDUCIAL3 = dock_v2:FIDUCIAL: Fiducials for optical coordinate reference
J1 = J-TE-5-104196-5-RA-1.27mm-female-th:5-104196-5
J2 = J-Harwin-M55-60X1642R-16pin-1.27mm-F-vertical:M55-6001642R; COPYRIGHT: Copyright (C) 2021 Ultra Librarian. All rights reserved.; DIGI-KEY_PART_NUMBER_1: 952-3836-2-ND; DIGI-KEY_PART_NUMBER_2: 952-3836-1-ND; DIGI-KEY_PART_NUMBER_3: 952-3836-6-ND; MANUFACTURER_PART_NUMBER: M55-6001642R; MFR_NAME: Harwin
R1-R10 = oresat-rcl:R-US_: RESISTOR, American symbol
U$1 = oresat-flight-marker:FLIGHMARKER

## Net classes
1 RF: width 0.38 mm, clearance 1 mm
2 SHUTDOWN: clearance 0.3 mm

## Board
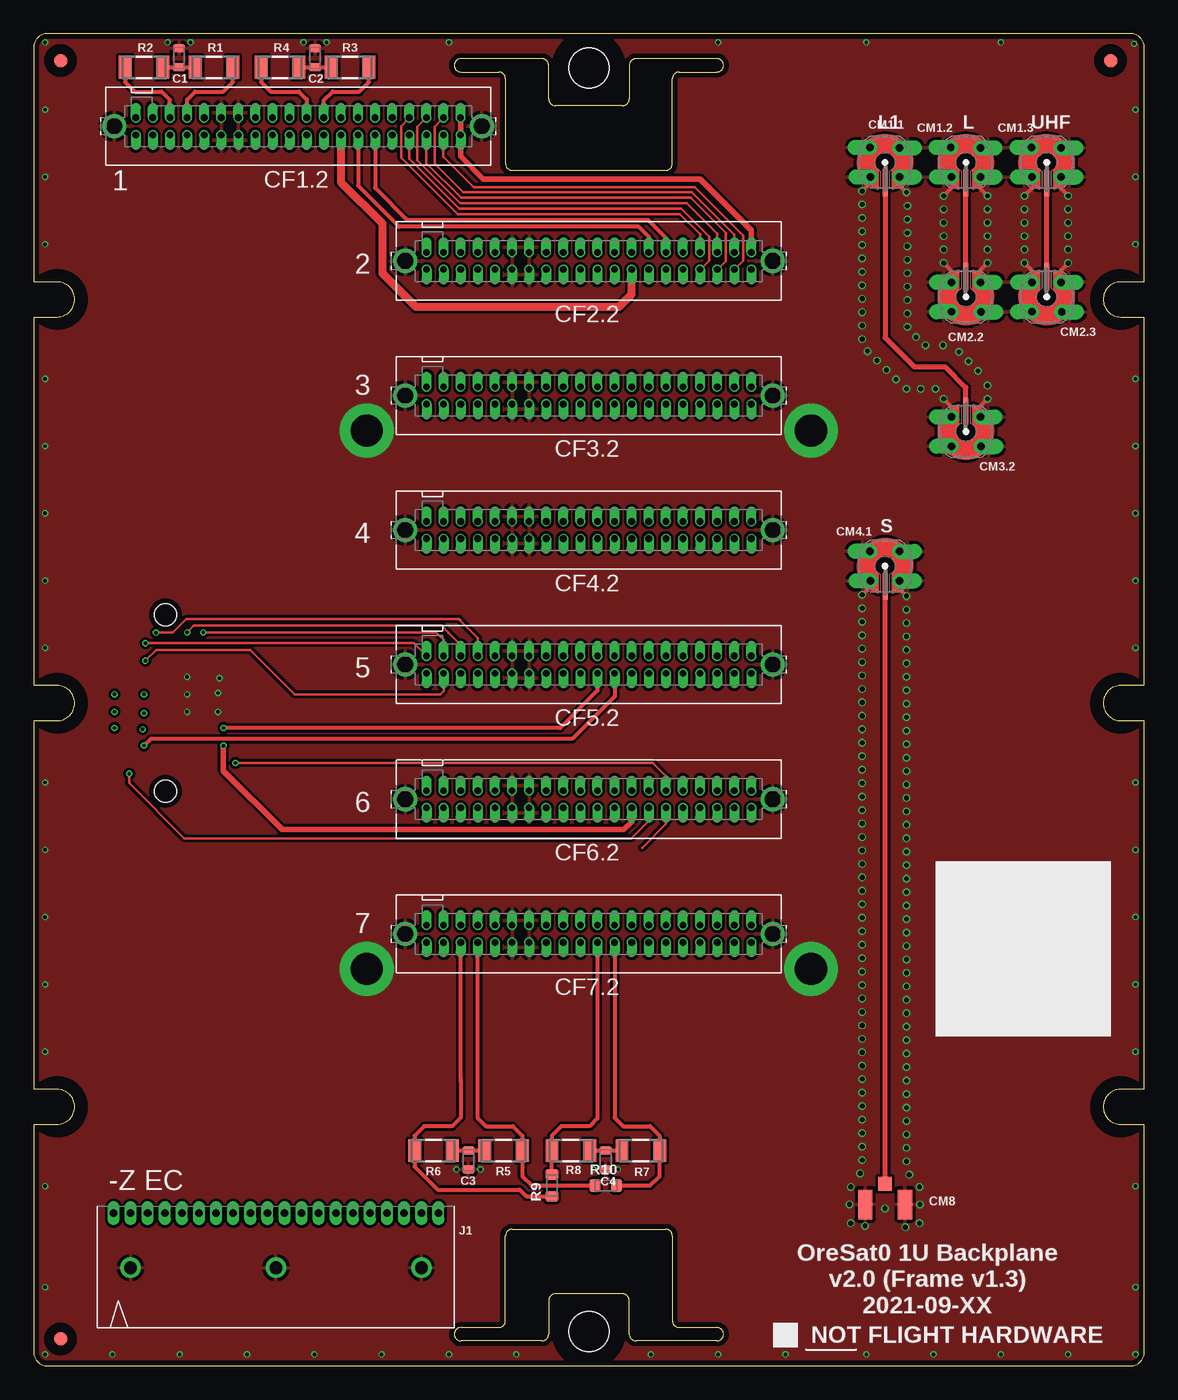
[diagram p9: board, top side]
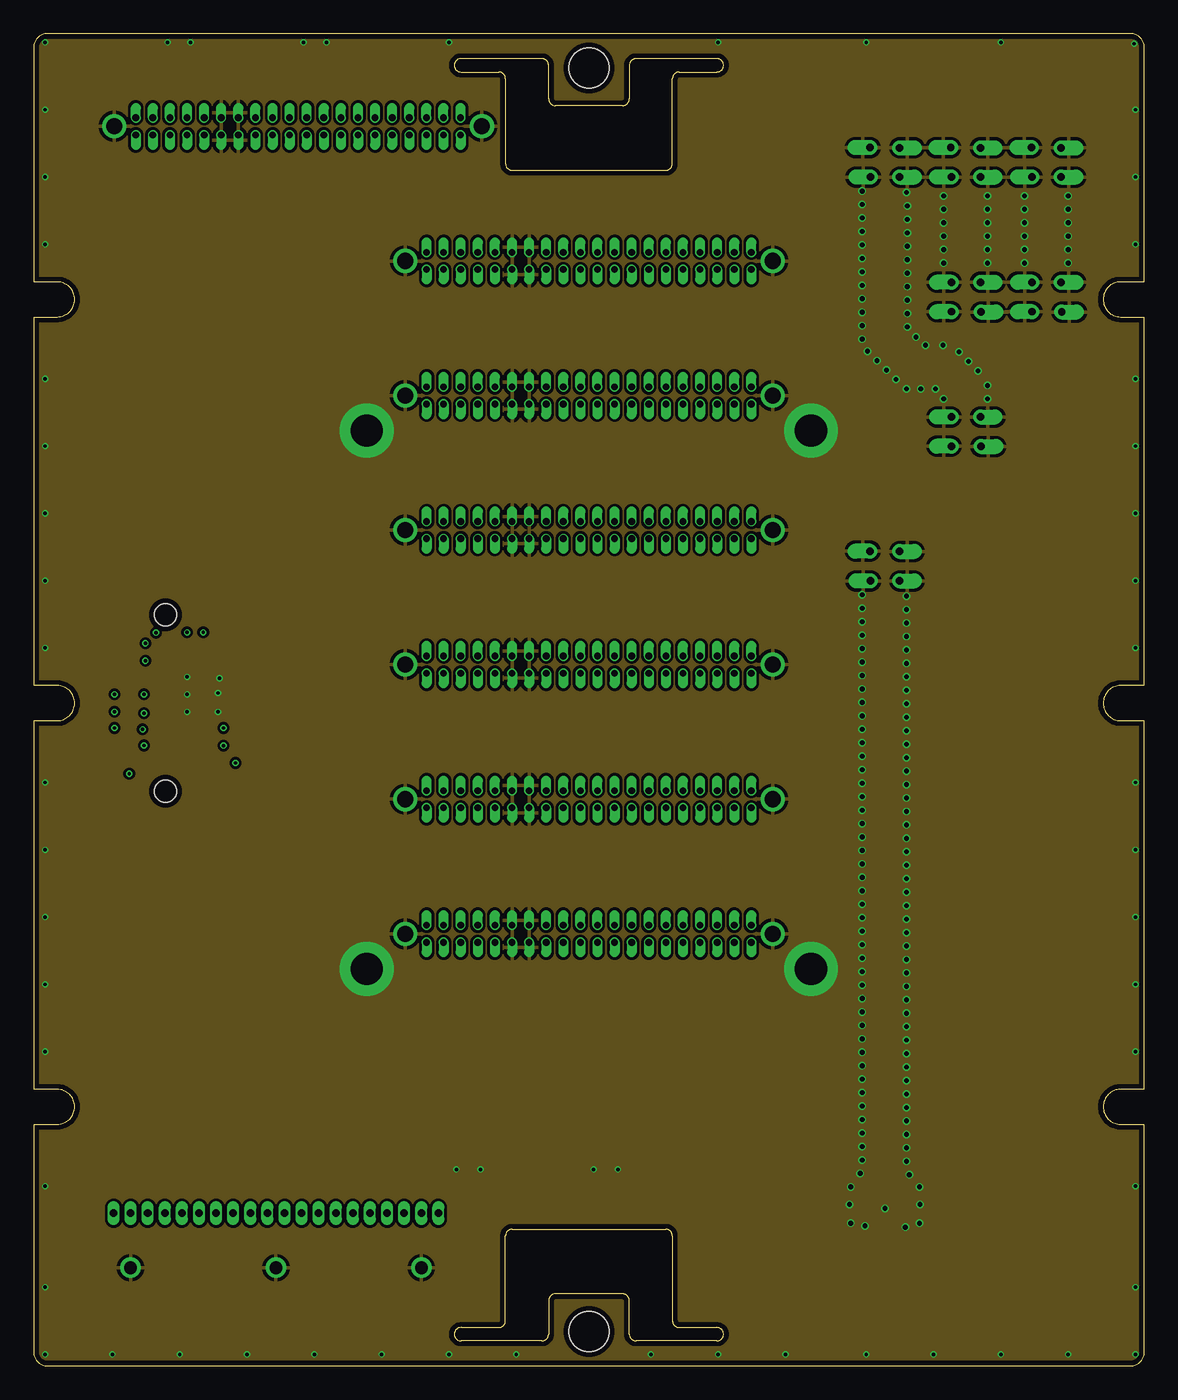
[diagram p10: board, inner layer Route2]
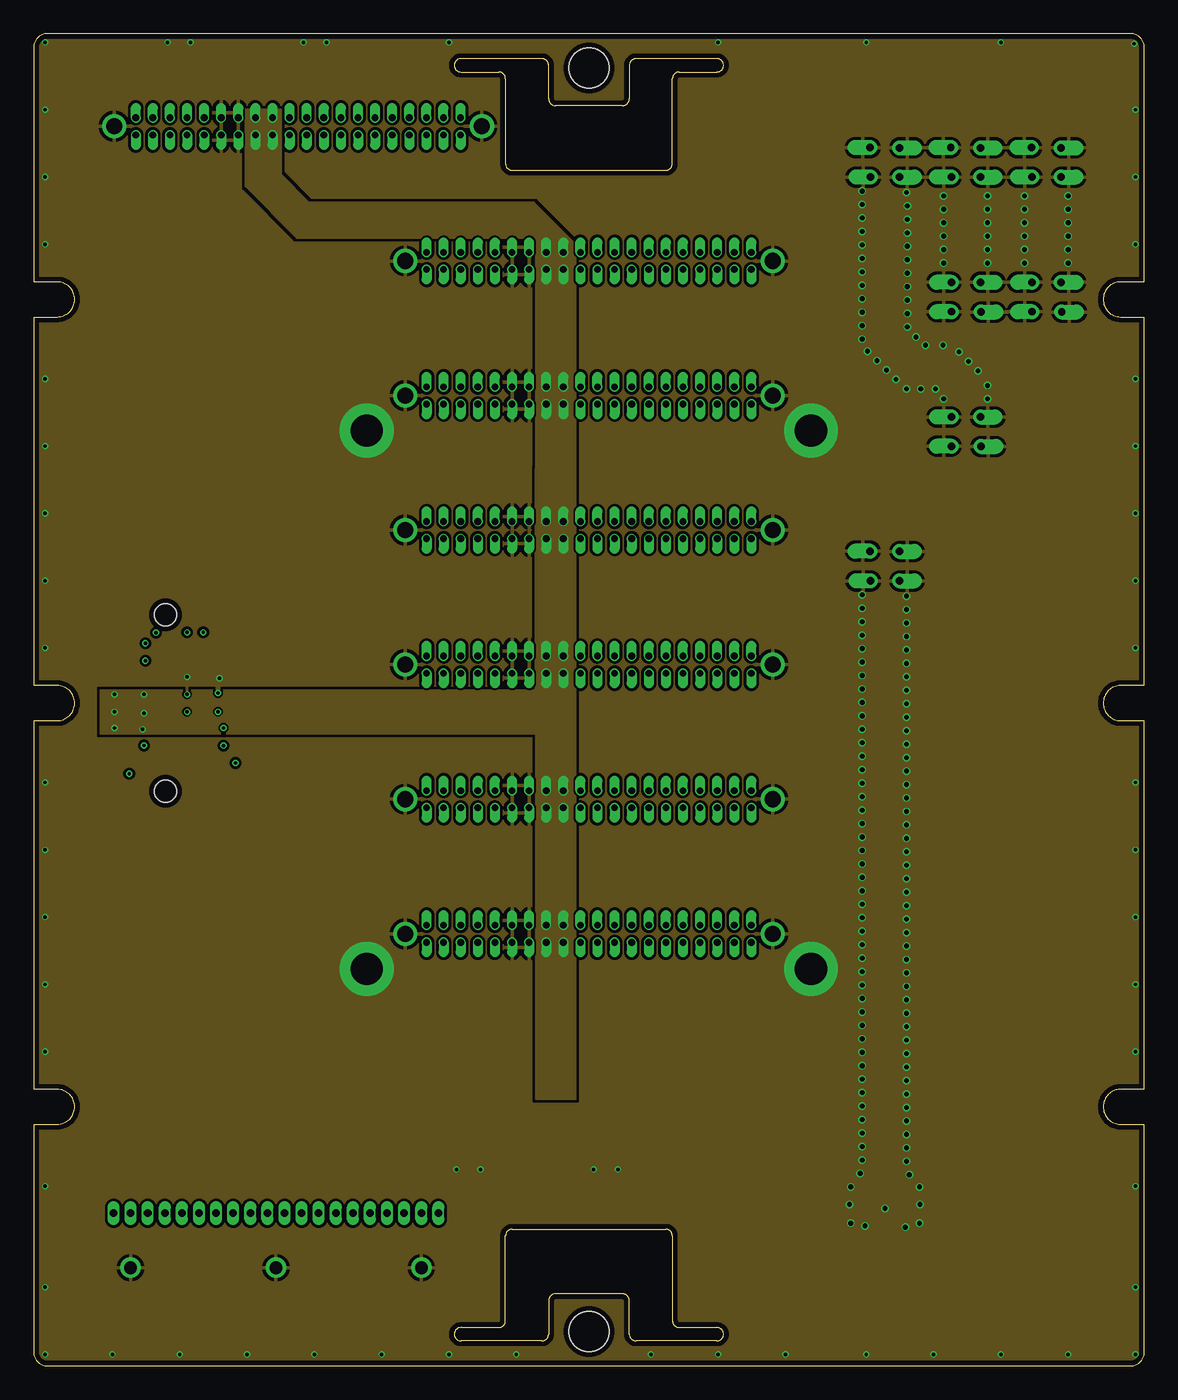
[diagram p11: board, inner layer Route15]
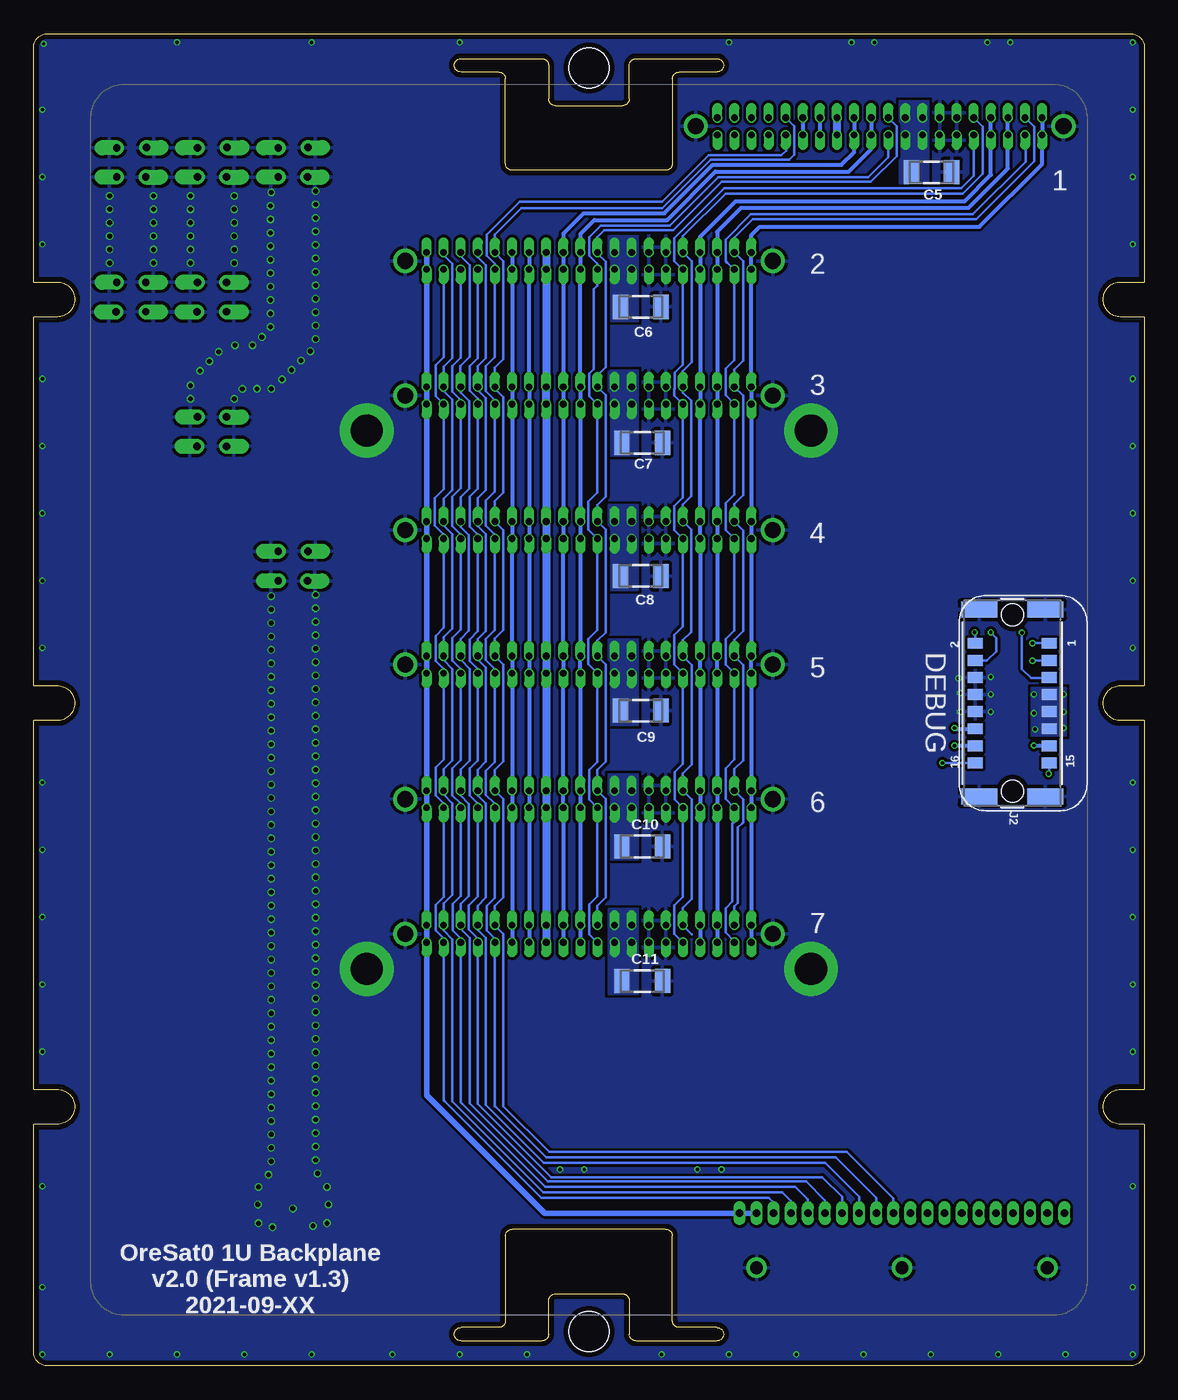
[diagram p12: board, bottom side, seen from below]

Size 82.5 x 99 mm. Coordinates in mm from the lower left corner, seen from the top.
Outline: 1,0 81.5,0 arc90 82.5,1 82.5,17.95 80.75,17.95 arc-180 80.75,20.55 82.5,20.55 82.5,47.95 80.75,47.95 arc-180 80.75,50.55 82.5,50.55 82.5,77.95 80.75,77.95 arc-180 80.75,80.55 82.5,80.55 82.5,98 arc90 81.5,99 1,99 arc90 0,98 0,80.55 1.75,80.55 arc-180 1.75,77.95 0,77.95 0,50.55 1.75,50.55 arc-180 1.75,47.95 0,47.95 0,20.55 1.75,20.55 arc-180 1.75,17.95 0,17.95 0,1 arc90 1,0
Outline: 37.75,97.15 31.75,97.15 arc180 31.75,96.15 34.55,96.15 arc-90 35.05,95.65 35.05,89.35 arc90 35.55,88.85 46.95,88.85 arc90 47.45,89.35 47.45,95.65 arc-90 47.95,96.15 50.75,96.15 arc180 50.75,97.15 44.75,97.15 arc90 44.25,96.65 44.25,94.15 arc-90 43.75,93.65 38.75,93.65 arc-90 38.25,94.15 38.25,96.65 arc90 37.75,97.15
Outline: 37.75,1.85 31.75,1.85 arc-180 31.75,2.85 34.55,2.85 arc90 35.05,3.35 35.05,9.65 arc-90 35.55,10.15 46.95,10.15 arc-90 47.45,9.65 47.45,3.35 arc90 47.95,2.85 50.75,2.85 arc-180 50.75,1.85 44.75,1.85 arc-90 44.25,2.35 44.25,4.85 arc90 43.75,5.35 38.75,5.35 arc90 38.25,4.85 38.25,2.35 arc-90 37.75,1.85
Copper layers (1*2*15*16): Top 0.035559375mm / dielectric 0.17018125mm / Route2 0.01778125mm / dielectric 47mil / Route15 0.01778125mm / dielectric 0.17018125mm / Bottom 0.035559375mm
Design rules "oshpark-4layer-tented": minimum track width 5mil, minimum drill 10mil, track to track 5mil, track to pad 5mil, pad to pad 5mil, via to via 5mil, smd to smd 5mil, copper to edge 15mil, drill to drill 6mil, minimum pad ring 4mil, minimum via ring 4mil, stop-mask expansion 2.5mil, vias tented up to drill 20mil, thermal gap 10mil
Holes 3 mm at 41.25,2.55 41.25,96.45
tRestrict: area 78.8,17.2 to 82.8,21.2; area 78.8,47.2 to 82.8,51.2; area 78.8,77.2 to 82.8,81.2; area -0.2,17.2 to 3.8,21.2; area -0.2,47.2 to 3.8,51.2; area -0.2,77.2 to 3.8,81.2; area 38.8,0 to 43.8,5; area 38.8,94 to 43.8,99

### Footprints (pad centres in the part's own frame; a part is rotated, then mirrored left to right if it is on the bottom)
.0603-C-NOSILK = smd 0.6 x 0.9: 1 -0.7,0; 2 0.7,0
1206-B = smd 1.15 x 1.8: 1 -1.5,0; 2 1.5,0
SFM-120-X1-XXX-D = drill 0.5 offset: 1 12.065,-0.635; 2 12.065,0.635; 3 10.795,-0.635; 4 10.795,0.635; 5 9.525,-0.635; 6 9.525,0.635; 7 8.255,-0.635; 8 8.255,0.635; 9 6.985,-0.635; 10 6.985,0.635; 11 5.715,-0.635; 12 5.715,0.635; 13 4.445,-0.635; 14 4.445,0.635; 15 3.175,-0.635; 16 3.175,0.635; 17 1.905,-0.635; 18 1.905,0.635; 19 0.635,-0.635; 20 0.635,0.635; 21 -0.635,-0.635; 22 -0.635,0.635; 23 -1.905,-0.635; 24 -1.905,0.635; 25 -3.175,-0.635; 26 -3.175,0.635; 27 -4.445,-0.635; 28 -4.445,0.635; 29 -5.715,-0.635; 30 -5.715,0.635; 31 -6.985,-0.635; 32 -6.985,0.635; 33 -8.255,-0.635; 34 -8.255,0.635; 35 -9.525,-0.635; 36 -9.525,0.635; 37 -10.795,-0.635; 38 -10.795,0.635; 39 -12.065,-0.635; 40 -12.065,0.635 | drill 1.194: LC1 13.652,0; LC2 -13.652,0
J-MOLEX-SMPM-73300-0111X = drill 0.55 pad 1.1 offset: P$1 -1.08,-1.09; P$2 1.12,-1.11; P$3 1.08,1.09; P$4 -1.08,1.09 | smd 0.38 x 2: RF-DOWN 0,1.5
U.FL-R-SMT = smd 1 x 1.05: 1 0,1.525 | smd 1.05 x 2.2: 2 -1.475,0; 3 1.475,0
FIDUCIAL-1.0X2.0 = smd 1 x 1: FIDUCIAL 0,0
5-104196-5 = drill 0.56 pad 0.9 long: 1 -12.065,0; 2 -10.795,0; 3 -9.525,0; 4 -8.255,0; 5 -6.985,0; 6 -5.715,0; 7 -4.445,0; 8 -3.175,0; 9 -1.905,0; 10 -0.635,0; 11 0.635,0; 12 1.905,0; 13 3.175,0; 14 4.445,0; 15 5.715,0; 16 6.985,0; 17 8.255,0; 18 9.525,0; 19 10.795,0; 20 12.065,0 | drill 0.94 pad 1.52: HD1 -10.8,-4.06; HD2 0,-4.06; HD3 10.8,-4.06
CONN_M55-6001642R_HRW = smd 0.813 x 1.092: 1 -4.445,2.75; 2 -4.445,-2.75; 3 -3.175,2.75; 4 -3.175,-2.75; 5 -1.905,2.75; 6 -1.905,-2.75; 7 -0.635,2.75; 8 -0.635,-2.75; 9 0.635,2.75; 10 0.635,-2.75; 11 1.905,2.75; 12 1.905,-2.75; 13 3.175,2.75; 14 3.175,-2.75; 15 4.445,2.75; 16 4.445,-2.75 | smd 1.194 x 2.692: 19 -6.94,-2.45; 20 6.94,-2.45; 21 -6.94,2.45; 22 6.94,2.45 | hole 1.651: -6.553,0; 6.553,0
1206-C = smd 0.95 x 1.7: 1 -1.4,0; 2 1.4,0
.0603-B-NOSILK = smd 0.8 x 0.95: 1 -0.8,0; 2 0.8,0

### Placement (x,y rotation side)
C1  10.8,97.2 90 top
C2  20.9,97.2 90 top
C3  32.3,15.3 270 top
C4  42.5,15.3 270 top
C5  15.8,88.7 0 bottom
C6  37.4,78.7 0 bottom
C7  37.3,68.6 0 bottom
C8  37.4,58.7 0 bottom
C9  37.4,48.7 0 bottom
C10  37.3,38.6 0 bottom
C11  37.3,28.6 0 bottom
CF1.2  19.65,92.11 0 top
CF2.2  41.25,82.11 0 top
CF3.2  41.25,72.11 0 top
CF4.2  41.25,62.11 0 top
CF5.2  41.25,52.11 0 top
CF6.2  41.25,42.11 0 top
CF7.2  41.25,32.11 0 top
CM1.1  63.25,89.43 180 top
CM1.2  69.25,89.43 180 top
CM1.3  75.25,89.43 180 top
CM2.2  69.25,79.43 0 top
CM2.3  75.25,79.43 0 top
CM3.2  69.25,69.43 0 top
CM4.1  63.25,59.43 180 top
CM8  63.25,12 0 top
FIDUCIAL1  80,97 0 top
FIDUCIAL2  2,97 0 top
FIDUCIAL3  2,2 0 top
J1  18,11.35 0 top
J2  9.8,49.25 270 bottom
R1  13.4,96.5 180 top
R2  8.2,96.5 0 top
R3  23.5,96.5 180 top
R4  18.3,96.5 0 top
R5  34.9,16 180 top
R6  29.7,16 0 top
R7  45.1,16 180 top
R8  39.9,16 0 top
R9  38.5,13.4 90 top
R10  42.5,13.4 0 top
U$1  55.2,1.7 0 top

### Tracks (layer width: path | path; a pad name or v marks a point on that pad's centre or on a via)
!SD  (via drill 0.25)
  Top 0.2: CF5.2.40 28.23,53.7 v8.3,53.7
  Bottom 0.2: v8.3,53.7 J2.1
  Bottom 0.3: CF7.2.39 CF7.2.40 CF6.2.39 CF6.2.40 CF5.2.39 CF5.2.40 CF4.2.39 CF4.2.40 CF3.2.39 CF3.2.40 CF2.2.39 CF2.2.40 29.18,84.02 28.55,84.65 12.25,84.65 7.58,89.31 CF1.2.39 CF1.2.40
C3-UART-RX  (via drill 0.25)
  Top 0.2: CF5.2.38 30.45,53.95 29.9,54.5 v12.6,54.5
  Bottom 0.2: CF7.2.38 30.45,34.15 30.2,34.4 30.2,40 29.88,40.32 29.8,40.4 29.8,42.09 CF6.2.38 30.45,44.34 29.8,45 29.8,50.53 29.8,52.09 CF5.2.38 30.45,53.95 29.8,54.6 29.8,62.09 CF4.2.38 30.45,64.05 29.8,64.7 29.8,72.09 CF3.2.38 30.45,74.05 29.8,74.7 29.8,82.09 CF2.2.38 30.45,83.84 29.07,85.23 12.47,85.23 8.19,89.51 8.19,92.08 CF1.2.38 | J2.2 12.55,54.45 v12.6,54.5
C3-UART-TX  (via drill 0.25)
  Top 0.2: CF5.2.37 30.45,50.16 30.2,49.9 19.4,49.9 16.09,53.2 9.11,53.2 v8.3,52.4
  Bottom 0.2: 30.4,31.42 CF7.2.37 30.45,31.55 31.1,32.2 31.1,34 30.6,34.5 30.6,40.3 30.5,40.4 30.5,41.43 CF6.2.37 31.1,42.12 31.1,44.4 30.45,45.05 CF5.2.37 31.1,52.12 31.1,54 30.45,54.65 CF4.2.37 31.1,62.12 31.1,64.1 30.45,64.75 CF3.2.37 31.1,72.12 31.1,74.1 30.45,74.75 CF2.2.37 30.98,82 31,82 31.1,82.1 31.1,83.7 29.23,85.57 26.9,85.57 12.73,85.57 8.8,89.5 8.8,91.42 CF1.2.37 | v8.3,52.4 7.08,52.4 J2.3
CAN1_H  (via drill 0.25)
  Top 0.2: CF5.2.34 32.99,54.1 31.7,55.4 31.6,55.5 11.34,55.5 10.34,54.5 9.26,54.5 v9.1,54.5 v9.09,54.49
  Top 0.3: CF1.2.34 11.39,94.09 12,94.7 14.1,94.7 14.8,95.4 R1.1 | R10.1 37,13.4 36.3,14.1 R5.1 36.3,17.1 35.6,17.8 33.6,17.8 32.99,18.41 CF7.2.33
  Bottom 0.2: v9.09,54.49 9.09,51.79 8.4,51.1 7.11,51.1 J2.5
  Bottom 0.3: 32.99,52.5 CF5.2.33 CF6.2.34 CF6.2.33 CF7.2.34 CF7.2.33 | 32.99,52.5 CF5.2.34 | CF1.2.34 CF1.2.33 11.39,88.5 13.35,86.55 30.35,86.55 32.99,83.91 CF2.2.34 CF2.2.33 CF3.2.34 CF3.2.33 CF4.2.34 CF4.2.33 32.99,52.5
CAN1_L  (via drill 0.25)
  Top 0.2: CF5.2.36 31.73,53.58 30.8,54.5 30.3,55 11.9,55 v11.4,54.5
  Top 0.3: CF1.2.36 10.12,94.08 9.5,94.7 7.5,94.7 6.8,95.4 R2.1 | 31.73,21.38 31.73,21.15 | 31.73,21.15 31.73,18.43 31.1,17.8 29,17.8 28.3,17.1 R6.1 28.3,14.8 30,13.1 36.1,13.1 36.6,12.6 R9.1 | 31.73,21.15 CF7.2.35
  Bottom 0.2: v11.4,54.5 11,54.1 11,53.1 11.7,52.4 12.53,52.4 J2.4
  Bottom 0.3: CF7.2.35 CF7.2.36 CF6.2.35 CF6.2.36 CF5.2.35 CF5.2.36 CF4.2.35 CF4.2.36 CF3.2.35 CF3.2.36 CF2.2.35 CF2.2.36 31.73,84.28 29.95,86.05 13.05,86.05 10.12,88.97 CF1.2.35 CF1.2.36
CAN2_H  (via drill 0.25)
  Top 0.3: CF1.2.18 21.55,94.06 22.2,94.7 24.2,94.7 24.9,95.4 R3.1 | R10.2 45.8,13.4 46.5,14.1 R7.1 46.5,17.1 45.8,17.8 43.8,17.8 43.16,18.45 CF7.2.17 | CF5.2.17 43.16,49.76 40,46.6 8.7,46.6 v8.2,46.1
  Bottom 0.3: CF1.2.18 CF1.2.17 21.55,90.19 22.49,89.25 32.05,89.25 35.65,85.65 41.65,85.65 43.16,84.14 CF2.2.18 CF2.2.17 CF3.2.18 CF3.2.17 CF4.2.18 CF4.2.17 CF5.2.18 CF5.2.17 CF6.2.18 CF6.2.17 CF7.2.18 CF7.2.17 | v8.2,46.1 7.08,46.1 J2.13
CAN2_L  (via drill 0.25)
  Top 0.3: R4.1 16.9,95.4 17.6,94.7 19.7,94.7 20.3,94.1 CF1.2.20 | R9.2 R8.1 38.5,17.1 39.2,17.8 41.3,17.8 41.88,18.39 CF7.2.19 | CF5.2.19 41.88,50.19 39.1,47.4 v14.1,47.4
  Bottom 0.3: CF1.2.20 CF1.2.19 20.29,90.42 21.95,88.75 31.85,88.75 35.45,85.15 40.85,85.15 41.88,84.11 CF2.2.20 41.88,81.6 | 41.88,81.6 CF2.2.19 | 41.88,81.6 CF3.2.20 CF3.2.19 CF4.2.20 CF4.2.19 CF5.2.20 CF5.2.19 CF6.2.20 CF6.2.19 CF7.2.20 CF7.2.19 | v14.1,47.4 14.04,47.34 J2.12
GND  (via drill 0.25, 0.35 pad 0.25, 2.4 pad 4)
  Top 0.3: CM4.1.P$3 62.17,57.92 v61.55,57.3 | CM4.1.P$4 64.33,57.72 v64.85,57.2 | CM3.2.P$4 68.17,71.28 v67.6,71.85 | CM3.2.P$3 70.33,71.33 v70.85,71.85 | CM2.2.P$4 68.17,81.38 v67.6,81.95 | CM2.2.P$3 70.33,81.43 v70.85,81.95 | CM2.3.P$4 74.17,81.38 v73.6,81.95 | CM2.3.P$3 76.33,81.43 v76.85,81.95 | CM1.3.P$4 76.33,87.47 v76.85,86.95 | CM1.3.P$3 74.17,87.52 v73.6,86.95 | CM1.2.P$4 70.33,87.47 v70.85,86.95 | CM1.2.P$3 68.17,87.52 v67.6,86.95 | CM1.1.P$4 64.33,87.72 v64.85,87.2 | CM1.1.P$3 62.17,87.92 v61.55,87.3
  other vias: 24.75,29.5 57.75,29.5 67.6,85.95 67.6,84.95 67.6,83.95 67.6,82.95 70.85,85.95 70.85,84.95 70.85,83.95 70.85,82.95 0.85,98.35 11.65,98.35 21.75,98.35 30.85,98.35 50.85,98.35 61.85,98.35 71.85,98.35 81.75,98.25 0.85,0.85 10.85,0.85 20.85,0.85 30.85,0.85 50.85,0.85 61.85,0.85 71.85,0.85 81.85,0.85 5.85,0.85 15.85,0.85 25.85,0.85 35.85,0.85 45.85,0.85 55.85,0.85 66.85,0.85 76.85,0.85 81.85,5.85 81.85,93.35 81.85,88.35 81.85,83.35 81.85,73.35 81.85,68.35 81.85,63.35 81.85,53.35 81.85,58.35 81.85,43.35 81.85,38.35 81.85,33.35 81.85,28.35 81.85,23.35 81.85,13.35 0.85,5.85 0.85,93.35 0.85,88.35 0.85,83.35 0.85,73.35 0.85,68.35 0.85,63.35 0.85,53.35 0.85,58.35 0.85,43.35 0.85,38.35 0.85,33.35 0.85,28.35 0.85,23.35 0.85,13.35 9.95,98.35 20.05,98.35 31.4,14.6 33.2,14.6 41.6,14.6 43.4,14.6 57.75,69.5 24.75,69.5 73.6,85.95 73.6,84.95 73.6,83.95 73.6,82.95 76.85,85.95 76.85,84.95 76.85,83.95 76.85,82.95 64.85,72.6 64.05,73.3 63.35,74 62.65,74.7 61.95,75.4 70.85,72.85 70.15,73.95 69.45,74.65 68.75,75.35 65.55,76.45 64.9,77.2 66.25,75.85 67.55,75.85 67,72.6 65.9,72.6 61.55,86.3 61.55,85.3 61.55,84.3 61.55,83.3 61.55,82.3 61.55,81.3 61.55,80.3 61.55,79.3 61.55,78.3 61.55,77.3 64.9,78.2 64.9,79.2 64.9,80.2 64.9,81.2 64.9,82.2 64.9,83.2 64.9,84.2 64.9,85.2 64.9,86.2 61.55,76.3 64.85,56.2 64.85,55.2 64.85,54.2 64.85,53.2 64.85,52.2 61.55,56.3 61.55,55.3 61.55,54.3 61.55,53.3 61.55,52.3 61.55,51.3 61.55,50.3 61.55,49.3 64.85,51.2 64.85,50.2 64.85,49.2 64.85,48.2 61.55,48.3 61.55,47.3 61.55,46.3 61.55,45.3 61.55,44.3 61.55,43.3 61.55,42.3 64.85,47.2 64.85,46.2 64.85,45.2 64.85,44.2 64.85,43.2 64.85,42.2 61.55,25.3 61.55,24.3 61.55,23.3 61.55,22.3 61.55,21.3 61.55,20.3 61.55,19.3 61.55,18.3 61.55,17.3 61.4,14.3 60.6,12 63.25,11.7 65.85,12 61.75,10.4 64.75,10.3 61.55,41.3 61.55,40.3 61.55,39.3 61.55,38.3 61.55,37.3 61.55,36.3 61.55,35.3 61.55,34.3 61.55,33.3 61.55,32.3 61.55,31.3 61.55,30.3 61.55,29.3 61.55,28.3 61.55,27.3 61.55,26.3 64.85,41.2 64.85,40.2 64.85,39.2 64.85,38.2 64.85,37.2 64.85,36.2 64.85,35.2 64.85,34.2 64.85,33.2 64.85,32.2 64.85,31.2 64.85,30.2 64.85,29.2 64.85,28.2 64.85,27.2 64.85,26.2 64.85,25.2 64.85,24.2 64.85,23.2 64.85,22.2 64.85,21.2 64.85,20.2 64.85,19.2 64.85,18.2 64.85,17.2 65.05,14.2 60.7,10.6 65.8,10.6 65.8,13.3 60.7,13.3 61.55,16.3 61.55,15.3 64.85,16.2 64.85,15.2 11.4,48.6 11.4,49.9 11.4,51.2 13.8,51.1 13.7,50 13.7,48.6
  pour Top (isolate 0.2, rank 6): 0,0 0,99 82.5,99 82.5,0
  pour Bottom (isolate 0.2, rank 6): 0,0 0,99 82.5,99 82.5,0
  pour Route2 (isolate 0.2, rank 6): 0,0 0,99 82.5,99 82.5,0
  pour Route15 (isolate 0.2, rank 6): 0,0 0,99 82.5,99 82.5,0
L1-TURNSTILE
  Top 0.38: CM3.2.RF-DOWN 69.25,72.7 67.7,74.25 65.4,74.25 63.25,76.4 CM1.1.RF-DOWN
L-TURNSTILE
  Top 0.38: CM2.2.RF-DOWN CM1.2.RF-DOWN
N$1
  Top 0.3: R4.2 C2.1 R3.2
N$2
  Top 0.3: R2.2 C1.1 R1.2
N$3
  Top 0.3: R8.2 C4.1 R7.2
N$4
  Top 0.3: R6.2 C3.1 R5.2
OPD_PWR  (via drill 0.25)
  Top 0.3: v14.1,46.1 v14.1,46.09
  Top 0.4: CF6.2.15 44.42,40.42 43.85,39.85 18.45,39.85 14.1,44.2 v14.1,46.1
  Top 0.6: CF1.2.15 22.82,87.97 25.9,84.9 25.9,81.2 28.4,78.7 43.5,78.7 44.42,79.62 CF2.2.15
  Bottom 0.3: v14.1,46.09 12.57,46.09 J2.14
  Bottom 0.6: CF1.2.16 CF1.2.15 | CF2.2.16 CF2.2.15 CF3.2.16 CF3.2.15 CF4.2.16 CF4.2.15 CF5.2.16 CF5.2.15 CF6.2.16 CF6.2.15 CF7.2.16 CF7.2.15
OPD_SCL  (via drill 0.25)
  Top 0.2: CF6.2.13 45.7,40.49 44.4,39.2 11.2,39.2 7.1,43.3 v7.1,44
  Top 0.3: CF1.2.13 24.09,87.7 27.15,84.65 44.95,84.65 45.7,83.91 CF2.2.14
  Bottom 0.2: v7.1,44 7.05,44.05 J2.15
  Bottom 0.3: CF1.2.14 CF1.2.13 | CF2.2.14 CF2.2.13 CF3.2.14 CF3.2.13 CF4.2.14 CF4.2.13 CF5.2.14 CF5.2.13 CF6.2.14 CF6.2.13 CF7.2.14 CF7.2.13
OPD_SDA  (via drill 0.25)
  Top 0.2: CF6.2.11 46.97,40.27 45.2,38.5 | CF6.2.12 46.97,43.84 46,44.8 v15,44.8
  Top 0.3: CF1.2.11 25.36,87.53 27.75,85.15 45.65,85.15 46.97,83.83 CF2.2.12
  Bottom 0.2: v15,44.8 J2.16
  Bottom 0.3: CF1.2.12 CF1.2.11 | CF2.2.12 CF2.2.11 CF3.2.12 CF3.2.11 CF4.2.12 CF4.2.11 CF5.2.12 CF5.2.11 CF6.2.12 CF6.2.11 CF7.2.12 CF7.2.11
S-PATCH
  Top 0.38: CM8.1 CM4.1.RF-DOWN
SPARE1
  Top 0.4: CF2.2.2 53.31,84.39 49.5,88.2 33.4,88.2 31.71,89.89 CF1.2.1 CF1.2.2
  Bottom 0.4: CF2.2.2 CF2.2.1 CF3.2.2 CF3.2.1 CF4.2.2 CF4.2.1 CF5.2.2 CF5.2.1 CF6.2.2 CF6.2.1 CF7.2.2 CF7.2.1 | CF7.2.1 53.31,31.29 | J1.19 J1.20 44.55,11.35 53.31,20.11 CF7.2.1
SPARE3
  Top 0.2: CF2.2.3 52.7,82.13 52.7,84 49.1,87.6 32.7,87.6 30.45,89.86 CF1.2.3
  Bottom 0.2: CF2.2.3 52.05,74.95 52.65,74.35 52.65,72.08 CF3.2.3 52.05,65.16 52.7,64.5 52.7,62.43 52.05,61.77 CF4.2.3 52.05,54.85 52.65,54.25 52.65,52.38 52.05,51.77 CF5.2.3 52.05,45.05 52.65,44.45 52.65,42.38 52.05,41.77 CF6.2.3 52.05,34.85 52.65,34.25 52.65,32.38 52.05,31.77 CF7.2.3 52.05,19.75 | 52.05,19.75 51.95,19.65 | 51.95,19.65 44.78,12.48 27.88,12.48 27.5,12.1 27.5,11.47 27.52,11.45 J1.18 | 52.05,19.75 51.95,19.65
SPARE4
  Top 0.2: CF2.2.4 52.03,82.76 52.03,84.07 48.9,87.2 31.93,87.2 29.8,89.33 29.8,92.1 CF1.2.4
  Bottom 0.2: CF2.2.4 52.05,82.55 51.4,81.9 51.4,74.9 52.05,74.25 CF3.2.4 52.05,72.44 51.4,71.8 51.4,65.1 52.05,64.45 CF4.2.4 52.05,62.45 51.4,61.8 51.4,54.8 52.05,54.16 CF5.2.4 52.05,52.45 51.4,51.8 51.4,45 52.05,44.35 CF6.2.4 52.05,42.45 51.4,41.8 51.4,35 52.05,34.35 CF7.2.4 52.05,32.34 51.4,31.7 51.4,19.66 44.64,12.9 26.9,12.9 26.25,12.26 J1.17
SPARE5
  Top 0.2: CF2.2.5 51.4,82.1 51.4,84.2 48.8,86.8 31.76,86.8 29.18,89.39 CF1.2.5
  Bottom 0.2: CF2.2.5 50.77,74.92 51.4,74.3 51.4,72.4 50.77,71.78 CF3.2.5 50.77,65.22 51.4,64.6 51.4,62.4 50.77,61.77 CF4.2.5 50.77,54.73 51.4,54.1 51.4,52.4 50.77,51.77 CF5.2.5 50.77,45.02 51.4,44.4 51.4,42.4 50.77,41.77 CF6.2.5 50.77,34.92 51.38,34.32 51.38,32.38 50.77,31.77 CF7.2.5 50.77,19.6 | 50.77,19.6 50.66,19.49 | 50.66,19.49 44.49,13.31 25.91,13.31 24.98,12.38 J1.16 | 50.77,19.6 50.66,19.49
SPARE6
  Top 0.2: CF2.2.6 50.77,84.12 48.5,86.4 31.7,86.4 28.51,89.59 28.51,91.72 28.5,91.73 28.5,92.07 CF1.2.6
  Bottom 0.2: CF2.2.6 50.77,82.47 50.1,81.8 50.1,81.73 50.11,81.72 50.11,80.48 50.1,80.47 50.1,75 50.8,74.3 50.8,72.77 CF3.2.6 50.77,72.33 50.15,71.7 50.15,65.2 50.77,64.58 CF4.2.6 50.77,62.33 50.17,61.72 50.17,54.63 50.77,54.02 CF5.2.6 50.77,52.48 50.1,51.8 50.1,51.73 50.11,51.72 50.11,44.99 50.77,44.33 CF6.2.6 50.77,42.38 50.17,41.77 50.17,34.93 50.77,34.33 CF7.2.6 50.77,32.48 50.1,31.8 50.1,31.73 50.11,31.72 50.11,19.51 44.3,13.7 25.1,13.7 23.71,12.31 J1.15
SPARE7
  Top 0.2: CF2.2.7 50.17,82.14 50.17,83.93 48.1,86 31.6,86 27.91,89.69 CF1.2.7
  Bottom 0.2: CF2.2.7 49.51,74.89 50.11,74.29 50.11,72.5 50.1,72.49 50.1,72.47 49.51,71.88 CF3.2.7 49.51,65.19 50.11,64.59 50.11,62.38 49.51,61.77 CF4.2.7 49.51,54.59 50.11,53.99 50.11,52.38 49.51,51.77 CF5.2.7 49.51,44.99 50.11,44.39 50.11,42.38 49.51,41.77 CF6.2.7 49.51,34.9 50.17,34.23 50.17,32.44 49.51,31.77 CF7.2.7 49.51,19.47 44.06,14.03 23.93,14.03 22.45,12.54 J1.14
SPARE8
  Top 0.2: CF2.2.8 49.51,84.09 48,85.6 31.5,85.6 27.3,89.8 27.3,92.14 CF1.2.8
  Bottom 0.2: CF2.2.8 49.51,82.41 48.9,81.8 48.9,74.9 49.51,74.3 CF3.2.8 49.51,72.5 48.9,71.9 48.9,65.1 49.51,64.5 CF4.2.8 49.51,62.41 48.9,61.8 48.9,54.6 49.51,53.99 CF5.2.8 49.51,52.51 48.9,51.9 48.9,51 48.9,44.9 49.51,44.3 CF6.2.8 49.51,42.41 48.9,41.8 48.9,34.8 49.51,34.2 CF7.2.8 49.51,32.41 48.9,31.8 48.9,24.9 48.9,19.4 44.6,15.1 23.7,15.1 21.18,12.57 J1.13
SPARE9
  Bottom 0.2: CF1.2.9 26.6,91.44 26.6,90.3 26.95,89.95 32.34,89.95 35.8,86.5 46.4,86.5 48.84,84.06 48.84,82.5 48.23,81.89 CF2.2.9 48.23,74.97 48.9,74.3 48.9,72.44 48.23,71.78 CF3.2.9 48.23,64.97 48.9,64.3 48.9,62.44 48.23,61.77 CF4.2.9 48.23,54.66 48.9,54 48.9,52.44 48.23,51.77 CF5.2.9 48.23,44.87 48.9,44.2 48.9,42.44 48.23,41.77 CF6.2.9 48.23,34.77 48.84,34.16 48.84,32.38 48.23,31.77 CF7.2.9 48.23,19.3 | J1.12 19.91,12.51 22.9,15.5 44.44,15.5 48.17,19.23 | 48.23,19.3 48.17,19.23 | 48.23,19.3 48.17,19.23
SPARE10
  Bottom 0.2: CF1.2.10 26,92.11 26,90 26.37,89.63 32.21,89.63 35.81,86.03 46.27,86.03 48.23,84.06 CF2.2.10 47.6,82.11 47.6,74.8 48.23,74.17 CF3.2.10 48.23,72.64 47.6,72 47.6,64.9 48.23,64.27 CF4.2.10 47.6,62.11 47.6,54.7 48.23,54.06 CF5.2.10 47.6,52.11 47.6,44.9 48.23,44.27 CF6.2.10 47.6,42.11 47.6,34.8 48.23,34.16 CF7.2.10 47.6,32.11 47.6,19.3 44.2,15.9 22.1,15.9 18.64,12.44 J1.11
SPARE21
  Bottom 0.2: CF1.2.21 19.02,89.81 20.5,88.33 31.64,88.33 35.23,84.73 40.37,84.73 41.22,83.88 41.22,82.5 40.62,81.89 CF2.2.21 40.62,80.28 40.9,80 40.9,74.06 41.22,73.74 41.22,72.08 CF3.2.21 40.62,64.89 41.28,64.22 41.28,62.14 CF4.2.21 40.62,54.69 41.28,54.02 41.28,52.14 CF5.2.21 40.62,44.88 41.22,44.28 41.22,42.08 CF6.2.21 40.62,34.88 41.22,34.28 41.22,32.08 CF7.2.21
SPARE22
  Bottom 0.2: CF1.2.22 18.4,92.13 18.4,89.9 20.3,88 31.4,88 35,84.4 40.1,84.4 40.62,83.89 CF2.2.22 40.62,82.66 40,82.04 40,74.2 40.62,73.58 CF3.2.22 40,72.13 40,64.6 40.62,63.98 CF4.2.22 40,62.13 40,54.5 40.62,53.88 CF5.2.22 40,52.13 40,44.9 40.62,44.28 CF6.2.22 40,42.13 40,34.8 40.62,34.19 CF7.2.22
SPARE31
  Bottom 0.2: CF1.2.31 12.66,88.44 13.6,87.5 31.2,87.5 34.9,83.8 34.9,82.11 CF2.2.31 34.27,74.4 34.87,73.8 34.87,72.63 34.9,72.6 34.9,72.11 CF3.2.31 34.27,64.53 34.9,63.9 34.9,62.11 CF4.2.31 34.27,54.94 34.9,54.3 34.9,52.11 CF5.2.31 34.27,44.73 34.87,44.13 34.87,42.08 CF6.2.31 34.27,34.84 34.9,34.2 34.9,32.11 CF7.2.31
SPARE32
  Bottom 0.2: CF1.2.32 12,92.08 12,88.6 13.5,87.1 31.1,87.1 34.27,83.94 CF2.2.32 33.6,82.08 33.6,74.6 34.27,73.94 CF3.2.32 34.27,72.33 33.66,71.72 33.66,64.64 34.3,64 34.3,62.78 | 34.3,62.78 CF4.2.32 | 34.3,62.78 33.66,62.14 33.66,54.54 33.7,54.5 34.27,53.94 CF5.2.32 33.6,52.08 33.6,44.7 34.27,44.03 CF6.2.32 33.6,42.08 33.6,34.7 34.27,34.03 CF7.2.32 33.6,32.08
UHF-TURNSTILE
  Top 0.38: CM2.3.RF-DOWN CM1.3.RF-DOWN
VBUS  (via drill 0.25)
  other vias: 8.1,47.3 8.2,48.5 8.2,49.9 6,49.9 6,48.6 6,47.4
  pour Route15 (rank 2, no thermals): 37.35,19.85 37.35,47 5,47 5,50.2 37.3,50.2 37.35,83.25 36.75,83.85 19.55,83.85 15.75,87.65 15.75,93.35 18.35,93.35 18.35,88.55 20.45,86.45 37.15,86.45 40.25,83.35 40.25,19.85
  pour Bottom (isolate 0.2, no thermals): 37.6,77.6 39.8,77.6 39.8,84 37.6,84
  pour Bottom (isolate 0.2, no thermals): 16,87.6 18.2,87.6 18.2,94 16,94
  pour Bottom (isolate 0.2, no thermals): 37.6,67.6 39.8,67.6 39.8,74 37.6,74
  pour Bottom (isolate 0.2, no thermals): 37.6,57.6 39.8,57.6 39.8,64 37.6,64
  pour Bottom (isolate 0.2, no thermals): 37.6,47.6 39.8,47.6 39.8,54 37.6,54
  pour Bottom (isolate 0.2, no thermals): 37.6,37.6 39.8,37.6 39.8,44 37.6,44
  pour Bottom (isolate 0.2, no thermals): 37.6,27.6 39.8,27.6 39.8,34 37.6,34
  pour Bottom (isolate 0.2, no thermals): 5.8,46.8 8.4,46.8 8.4,50.4 5.8,50.4

### Text on the board
tPlace: L1 | L | UHF | 1 | 2 | 3 | S | 4 | 5 | 6 | 7 | -Z EC | OreSat0 1U Backplane / v2.0 (Frame v1.3) / 2021-09-XX
bPlace: 1 | 2 | 3 | 4 | DEBUG | 5 | 6 | 7 | OreSat0 1U Backplane / v2.0 (Frame v1.3) / 2021-09-XX